# EAGLE design PolyMath (EAGLE 9.6.2)

## Sheet 1 of 7
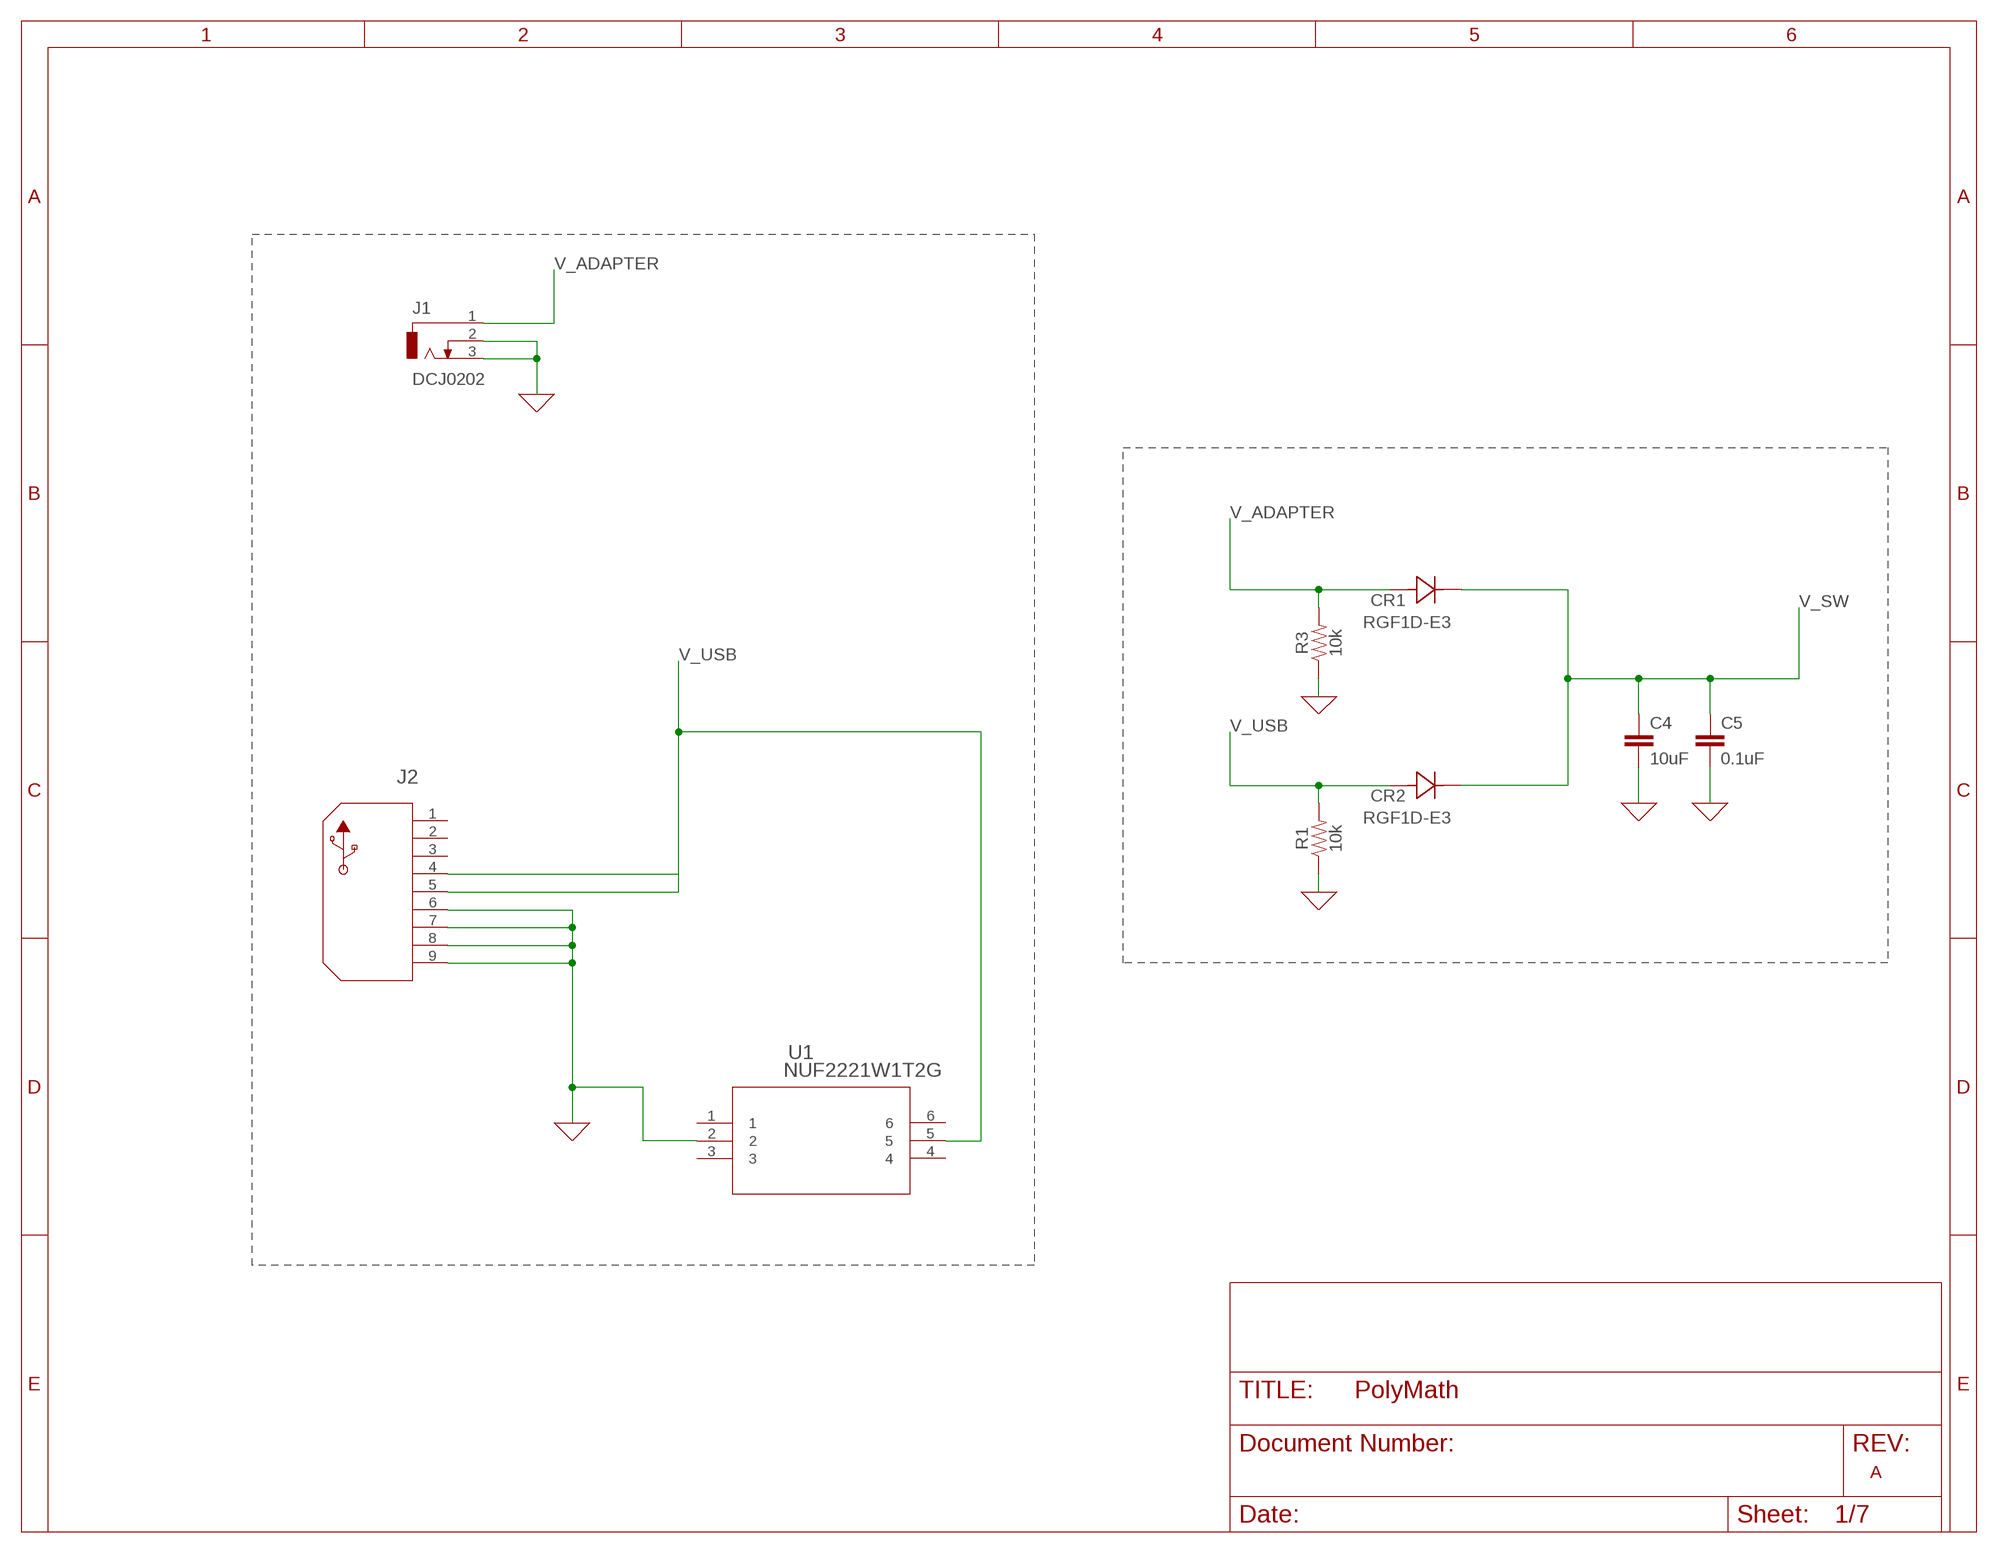
[diagram p0: schematic, sheet 1]

### Parts
C4  10uF  10UF-0603-6.3V-20%  [0603]
C5  0.1uF  0.1UF-0603-25V-(+80/-20%)  [0603]
CR1  RGF1D-E3  [DIODE_DO214BA]
CR2  RGF1D-E3  [DIODE_DO214BA]
J1  DCJ0202  [DCJ0202]
J2  1734035-4  [CONN5_USB1734035_TEC]
R1  10k  10KOHM-0603-1/10W-1%  [0603]
R3  10k  10KOHM-0603-1/10W-1%  [0603]
U1  NUF2221W1T2G  [SOIC6_SC70_1P35X2P2_ONS]

### Nets
0: C4.2 C5.2 J1.2 J1.3 J2.6 J2.7 J2.8 J2.9 R1.1 R3.1 U1.2 ; supply symbol labelled GND ; also sheet 2,3,4,5,6,7
V_ADAPTER: CR1.2 J1.1 R3.2
V_SW: C4.1 C5.1 CR1.1 CR2.1 ; also sheet 2
V_USB: CR2.2 J2.4 J2.5 R1.2 U1.5
Unconnected: J2.1 J2.2 J2.3 U1.1 U1.3 U1.4 U1.6

### Notes on the sheet
- A

## Sheet 2 of 7
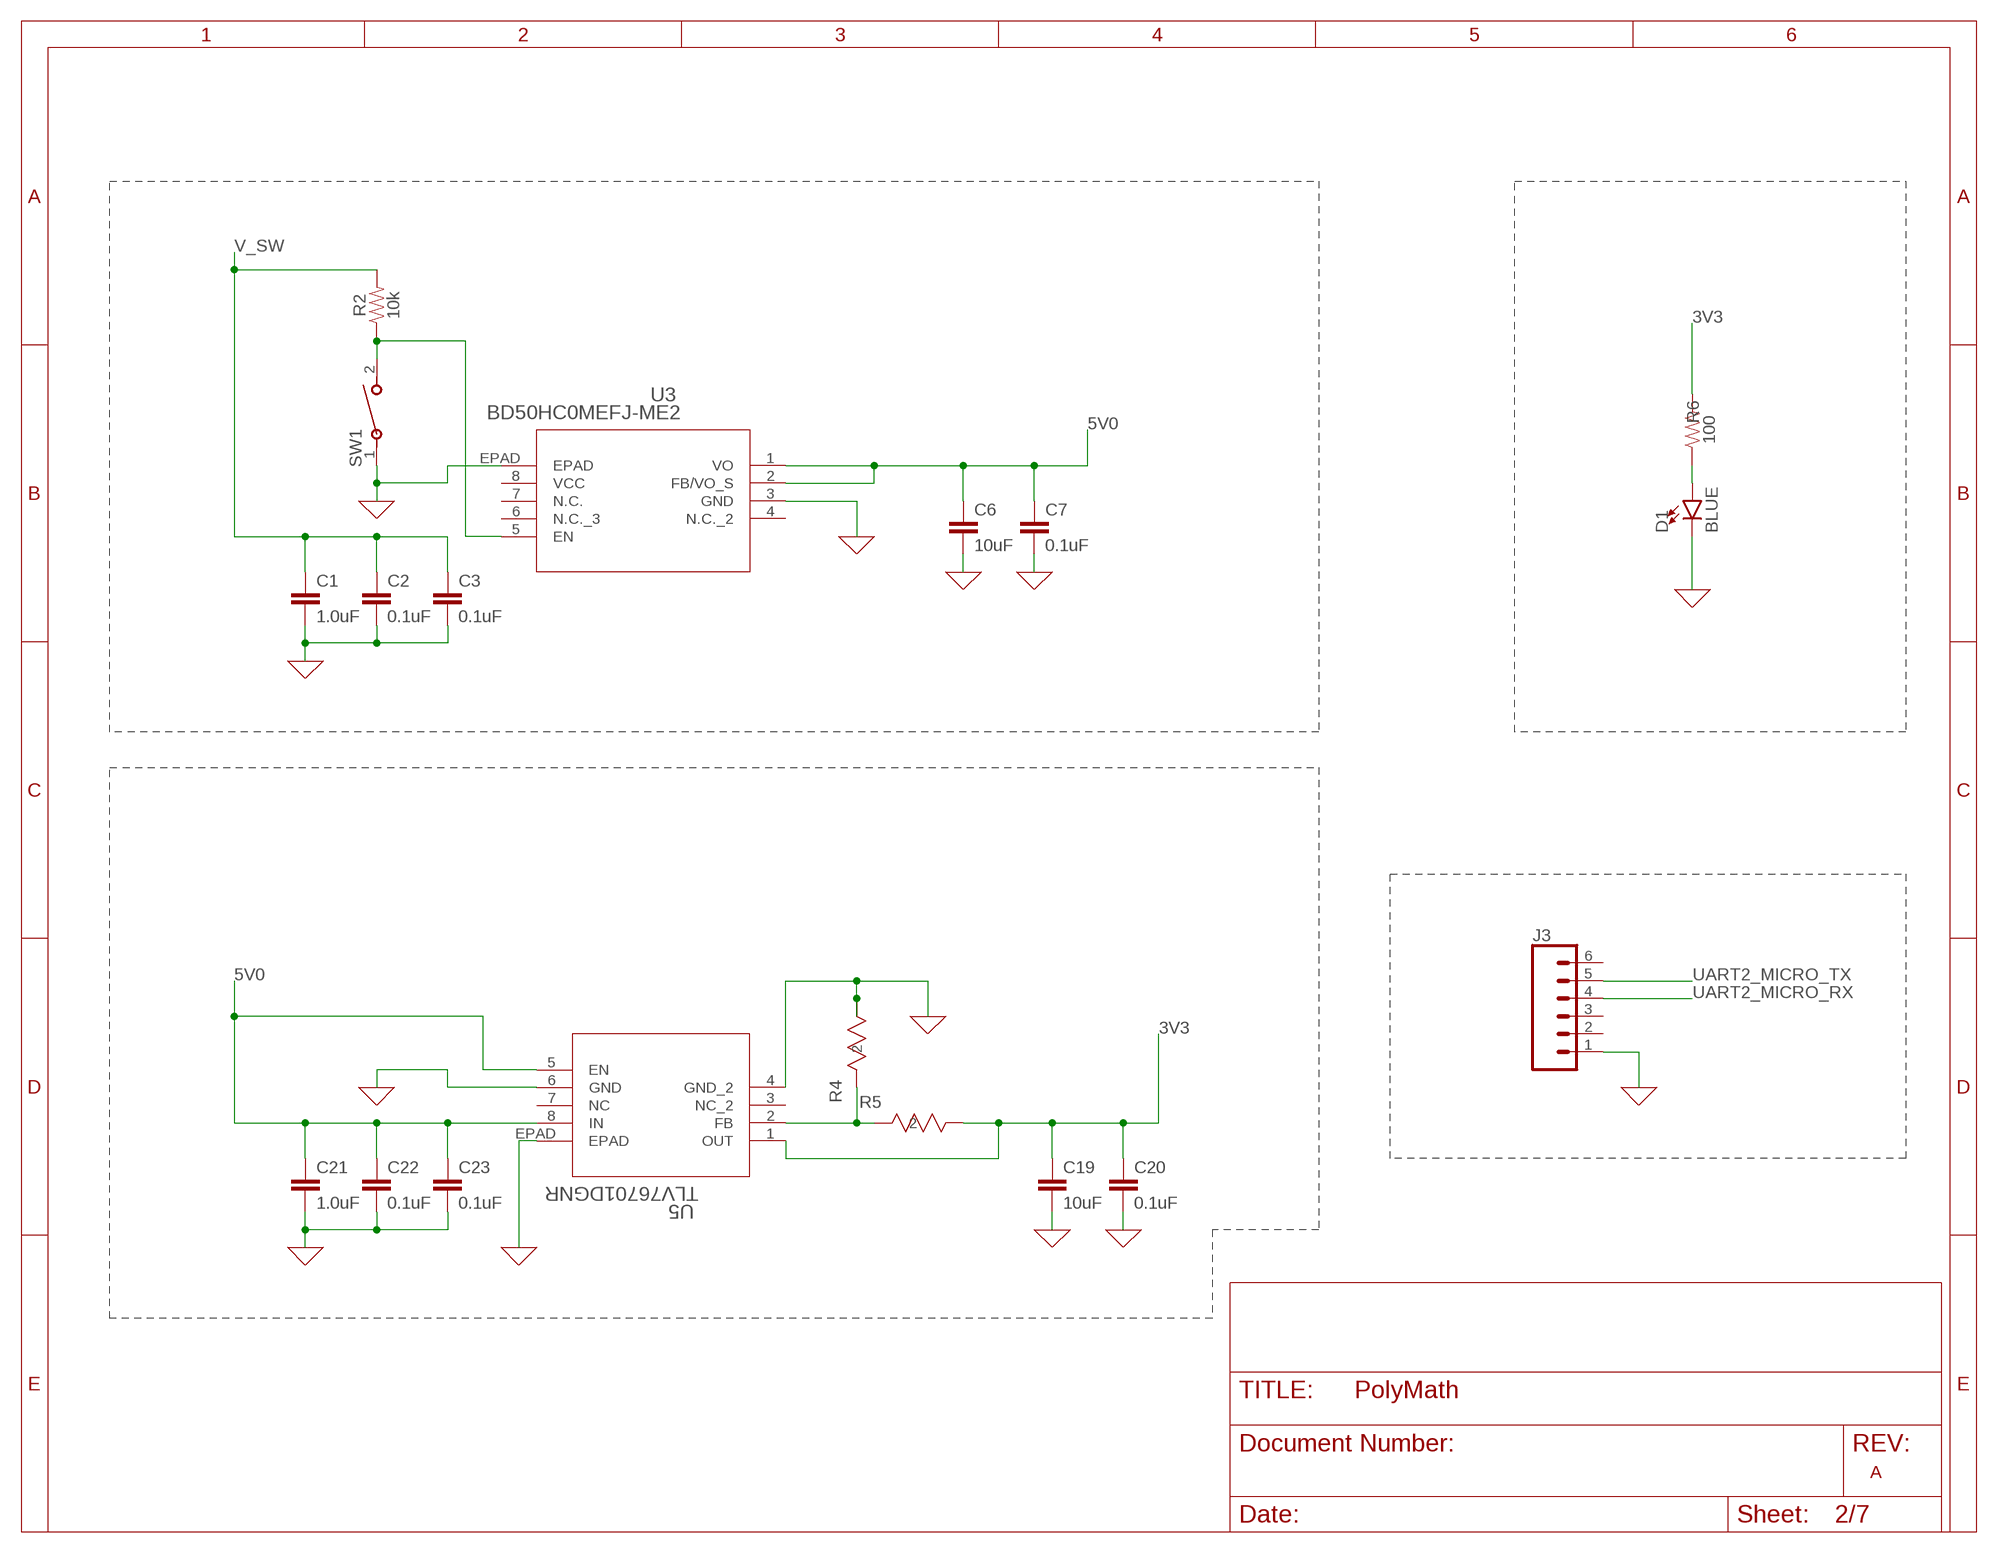
[diagram p1: schematic, sheet 2]

### Parts
C1  1.0uF  1.0UF-0603-16V-10%  [0603]
C2  0.1uF  0.1UF-0603-25V-5%  [0603]
C3  0.1uF  0.1UF-0603-25V-5%  [0603]
C6  10uF  10UF-0603-6.3V-20%  [0603]
C7  0.1uF  0.1UF-0603-25V-(+80/-20%)  [0603]
C19  10uF  10UF-0603-6.3V-20%  [0603]
C20  0.1uF  0.1UF-0603-25V-(+80/-20%)  [0603]
C21  1.0uF  1.0UF-0603-16V-10%  [0603]
C22  0.1uF  0.1UF-0603-25V-5%  [0603]
C23  0.1uF  0.1UF-0603-25V-5%  [0603]
D1  BLUE  LED-BLUE0603  [LED-0603]
J3  CONN_06NO_SILK_FEMALE_PTH  [1X06_NO_SILK]
R2  10k  10KOHM-0603-1/10W-1%  [0603]
R4  TNPW0603160KBEEA  [RC0603N_VIS]
R5  CRCW0603499KFKEA  [RES_CRCW_0603]
R6  100  100OHM-0603-1/4W-5%  [0603]
SW1  TL9320AF400QG  [SW_TL9320_EWI]
U3  BD50HC0MEFJ-ME2  [HTSOP-J8_ROM]
U5  TLV76701DGNR  [SOIC_01DGNR_TEX]

### Nets
0: C1.2 C2.2 C3.2 C6.2 C7.2 C19.2 C20.2 C21.2 C22.2 C23.2 D1.C J3.1 R4.1 SW1.1 U3.3(GND) U3.EPAD U5.4(GND_2) U5.6(GND) U5.EPAD ; supply symbol labelled GND ; also sheet 1,3,4,5,6,7
3V3: C19.1 C20.1 R5.1 R6.2 U5.1(OUT) ; also sheet 3,4,5,6,7
5V0: C6.1 C7.1 C21.1 C22.1 C23.1 U3.1(VO) U3.2(FB/VO_S) U5.5(EN) U5.8(IN) ; also sheet 4,5,6,7
N$1: R2.1 SW1.2 U3.5(EN)
N$4: D1.A R6.1
N$8: R4.2 R5.2 U5.2(FB)
UART2_MICRO_RX: J3.4 ; also sheet 4,7
UART2_MICRO_TX: J3.5 ; also sheet 4,7
V_SW: C1.1 C2.1 C3.1 R2.2 ; also sheet 1
Unconnected: J3.2 J3.3 J3.6 U3.4(N.C._2) U3.6(N.C._3) U3.7(N.C.) U5.3(NC_2) U5.7(NC)

### Notes on the sheet
- A

## Sheet 3 of 7
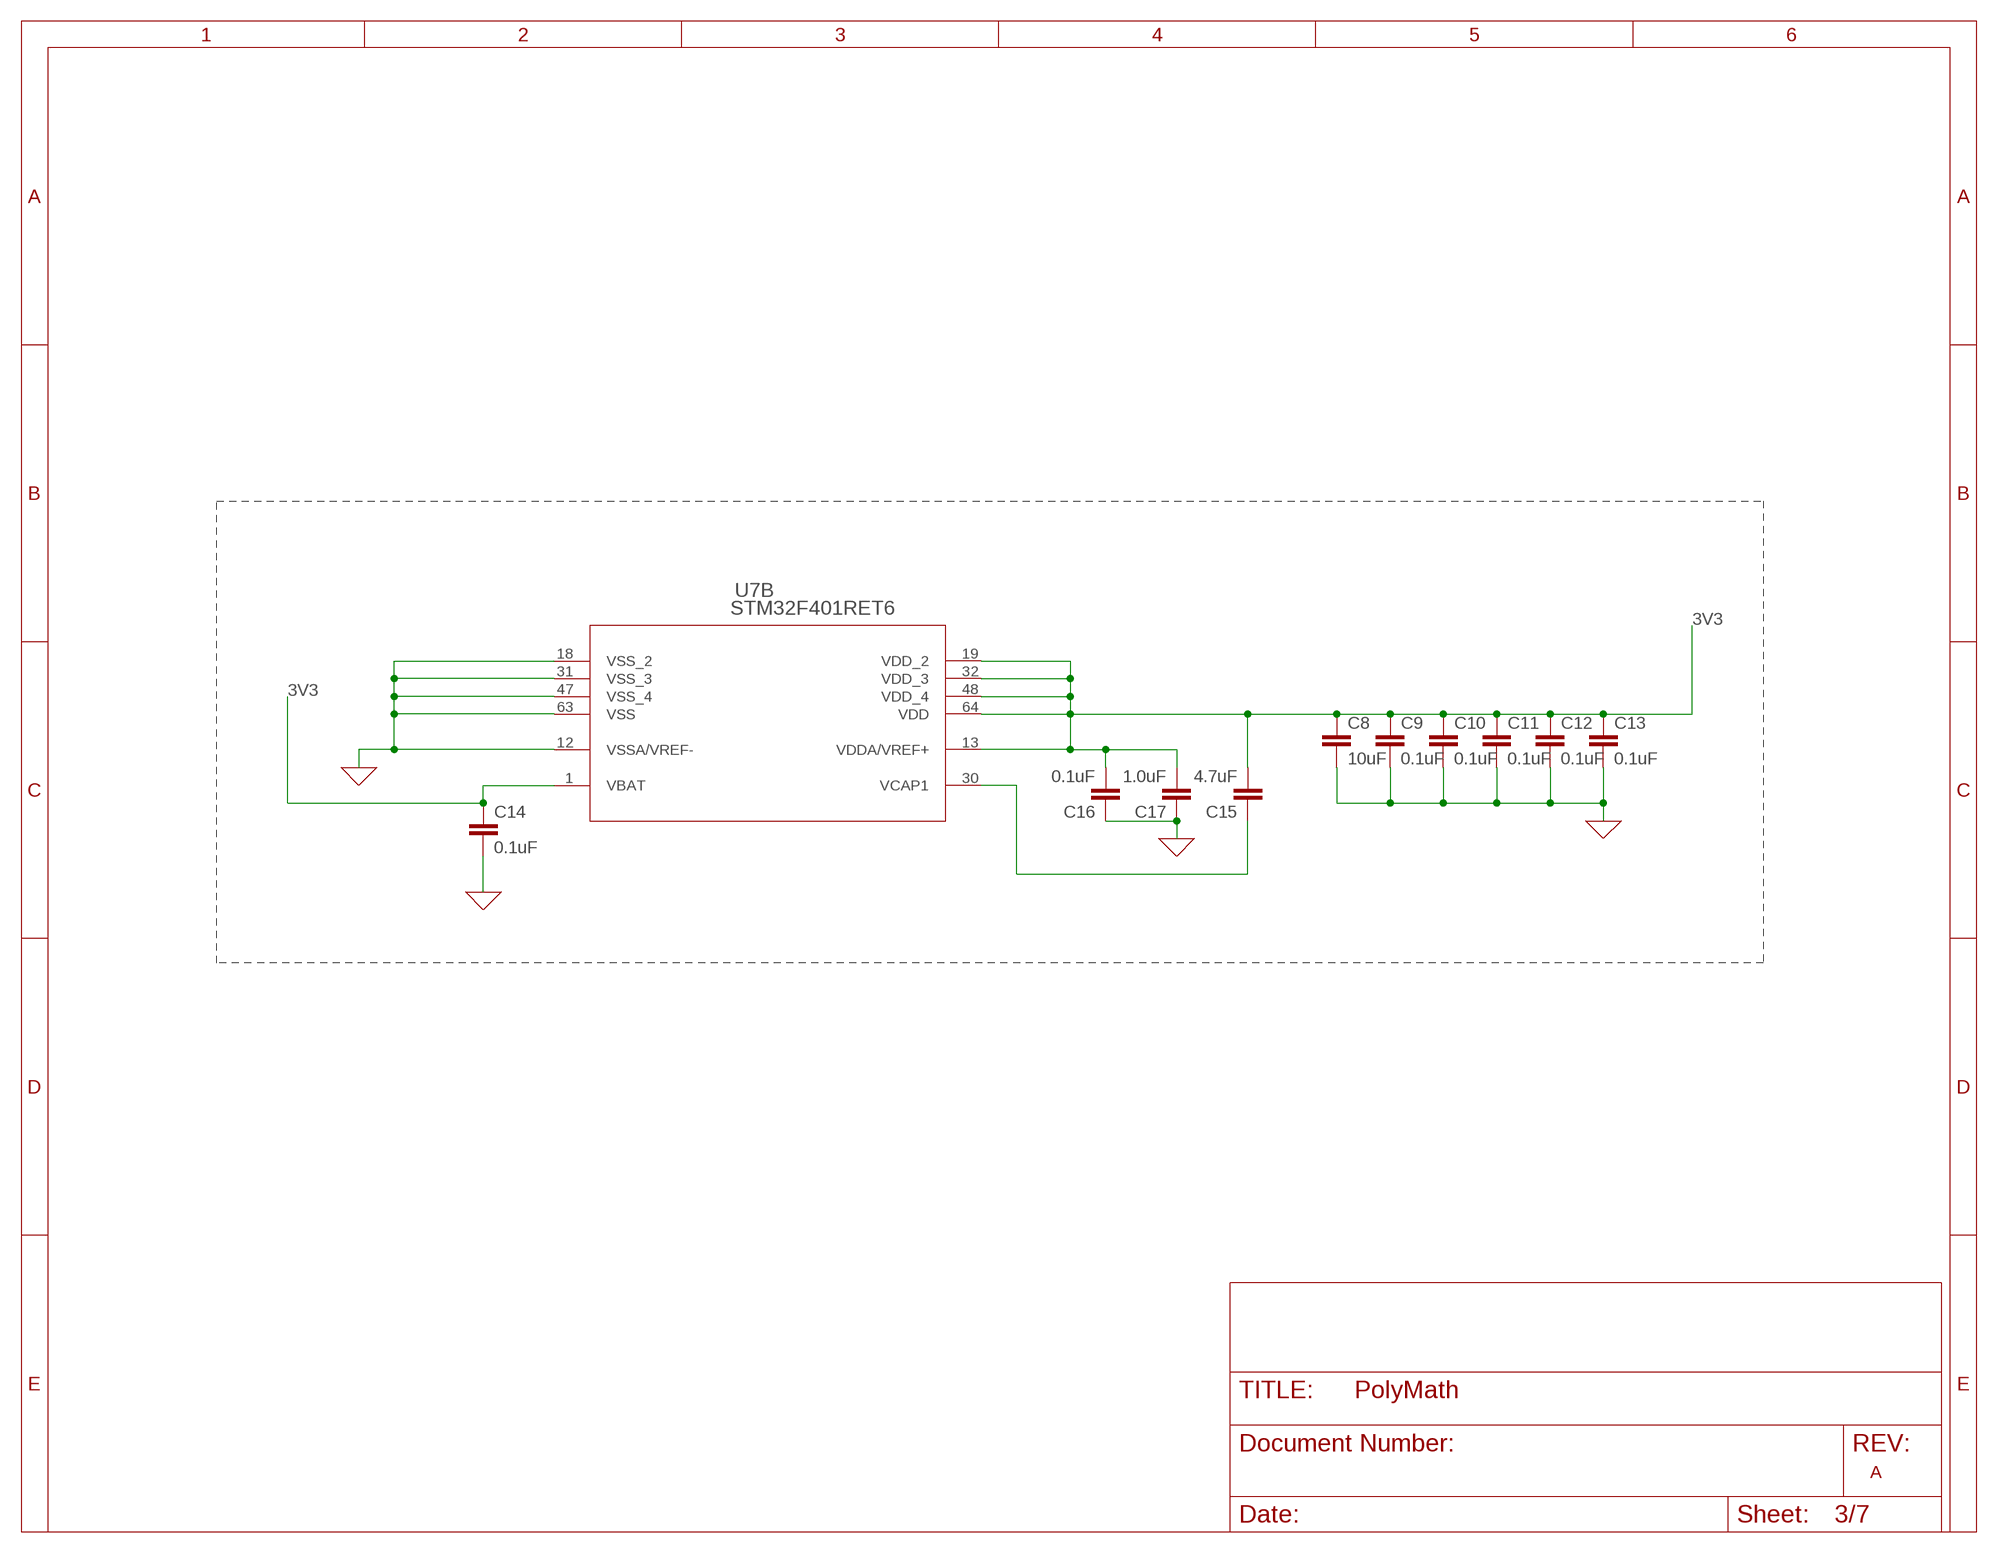
[diagram p2: schematic, sheet 3]

### Parts
C8  10uF  10UF-0805-10V-10%  [0805]
C9  0.1uF  0.1UF-0603-25V-5%  [0603]
C10  0.1uF  0.1UF-0603-25V-5%  [0603]
C11  0.1uF  0.1UF-0603-25V-5%  [0603]
C12  0.1uF  0.1UF-0603-25V-5%  [0603]
C13  0.1uF  0.1UF-0603-25V-5%  [0603]
C14  0.1uF  0.1UF-0603-25V-5%  [0603]
C15  4.7uF  4.7UF-0603-35V-(20%)  [0603]
C16  0.1uF  0.1UF-0603-25V-5%  [0603]
C17  1.0uF  1.0UF-0805-25V-(+80/-20%)  [0805]
U7  STM32F401RET6  [LQFP64-10X10MM]

### Nets
0: C8.2 C9.2 C10.2 C11.2 C12.2 C13.2 C14.2 C16.1 C17.1 U7.12(B:VSSA/VREF-) U7.18(B:VSS_2) U7.31(B:VSS_3) U7.47(B:VSS_4) U7.63(B:VSS) ; supply symbol labelled GND ; also sheet 1,2,4,5,6,7
3V3: C8.1 C9.1 C10.1 C11.1 C12.1 C13.1 C14.1 C15.2 C16.2 C17.2 U7.1(B:VBAT) U7.13(B:VDDA/VREF+) U7.19(B:VDD_2) U7.32(B:VDD_3) U7.48(B:VDD_4) U7.64(B:VDD) ; also sheet 2,4,5,6,7
N$7: C15.1 U7.30(B:VCAP1)

### Notes on the sheet
- A

## Sheet 4 of 7
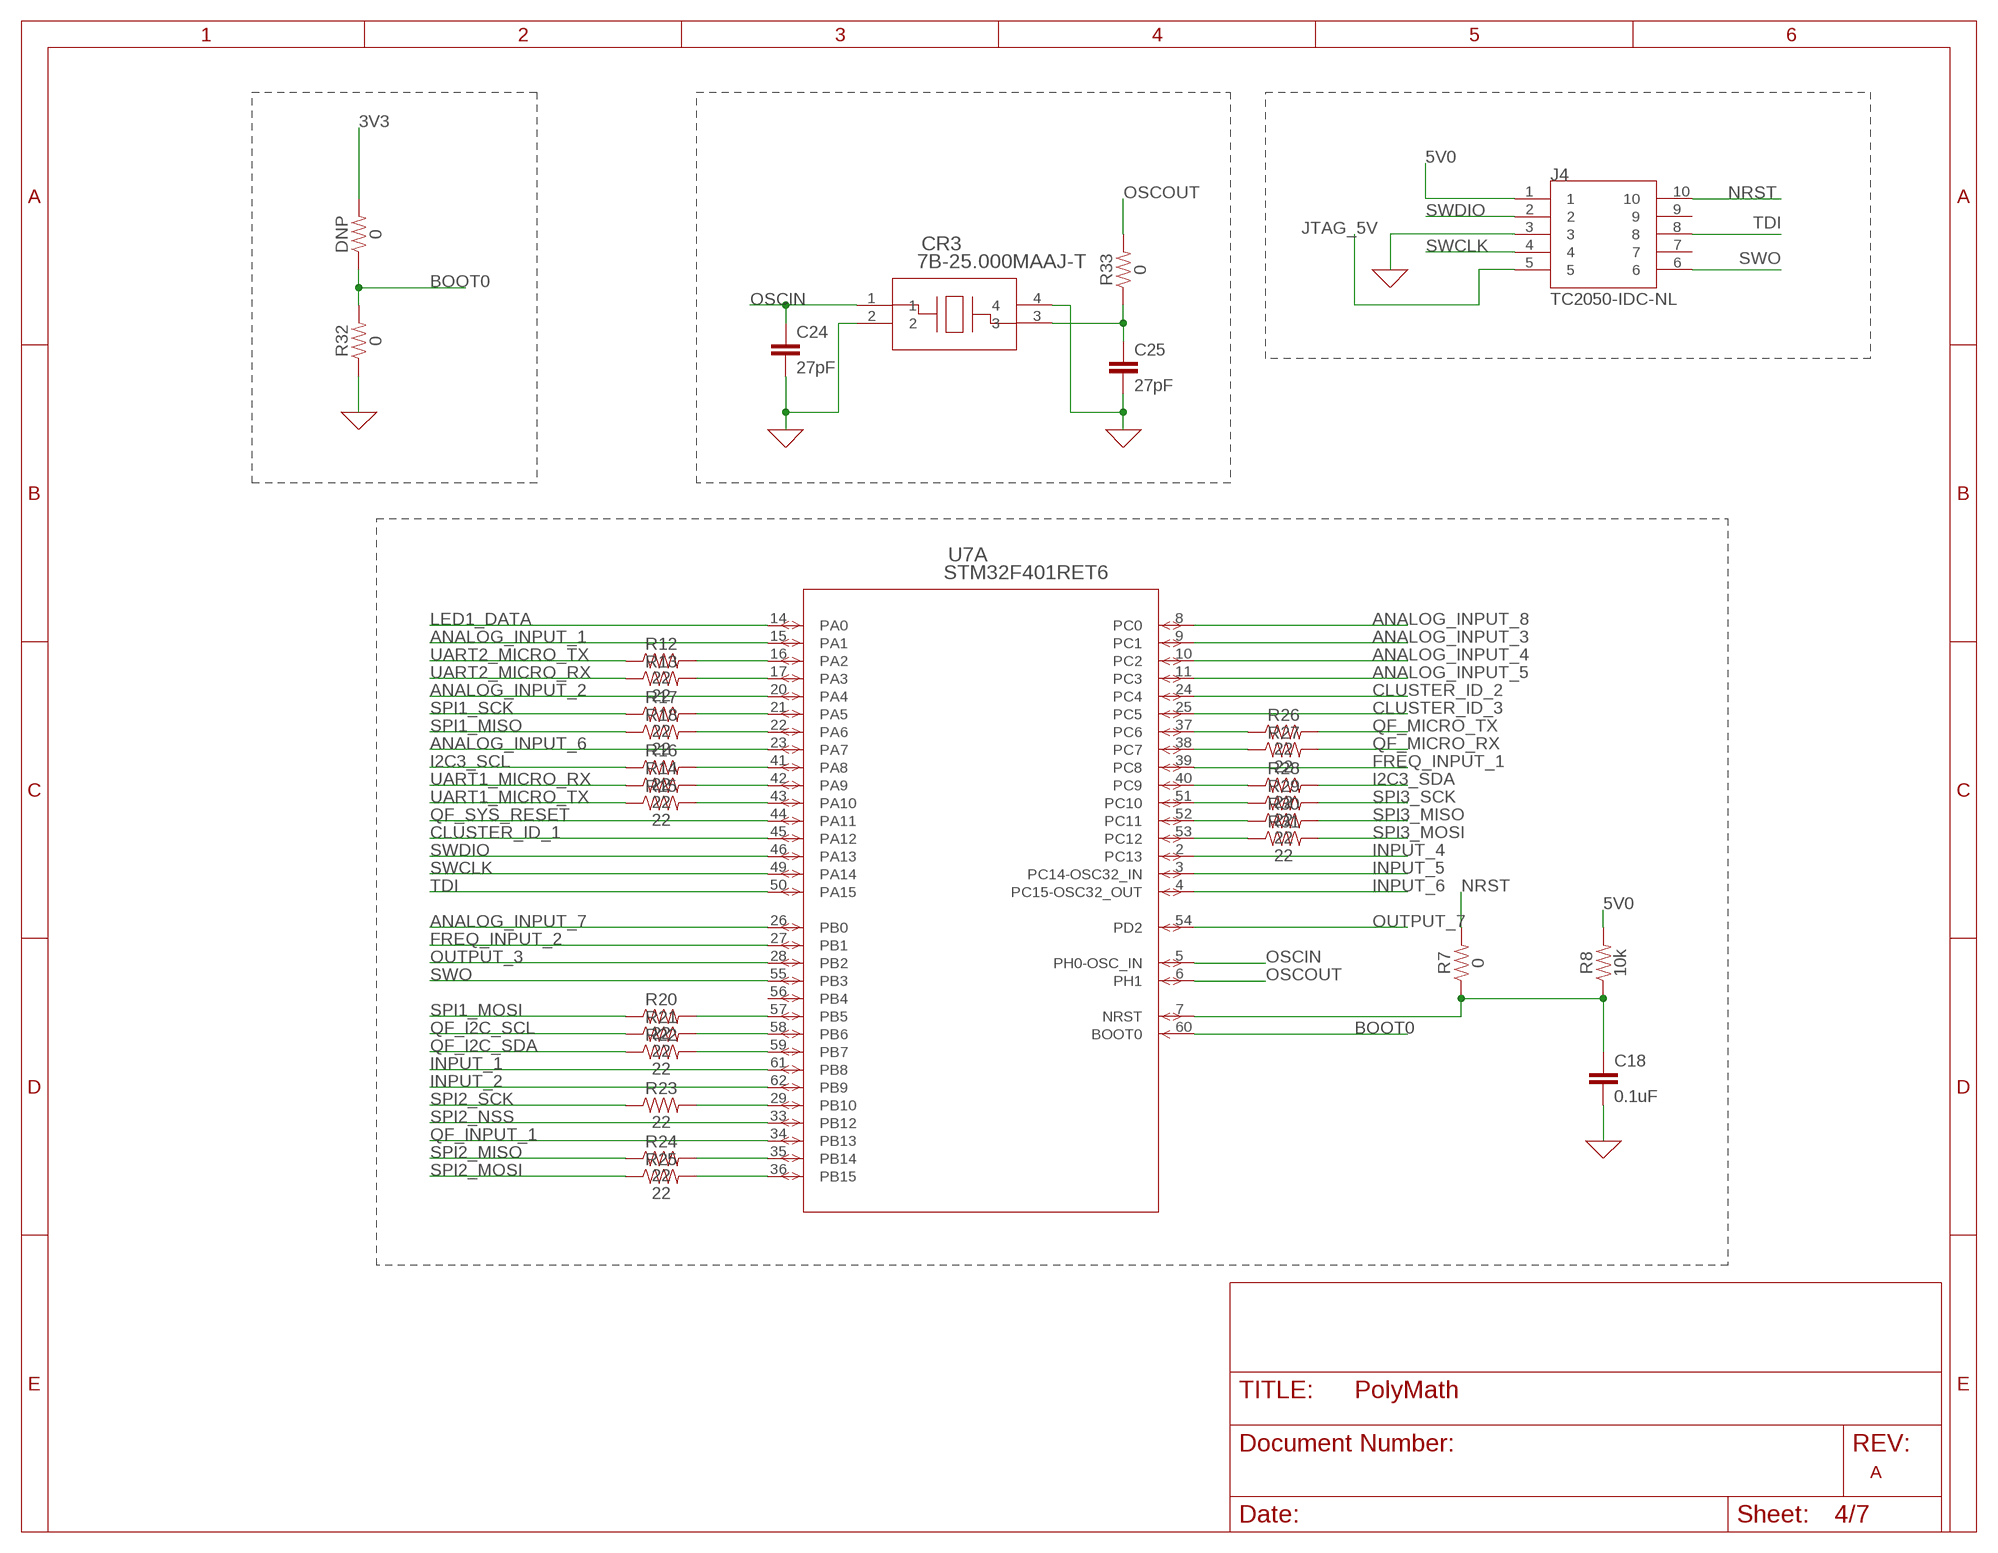
[diagram p3: schematic, sheet 4]

### Parts
C18  0.1uF  0.1UF-0603-25V-5%  [0603]
C24  27pF  27PF-0603-50V-5%  [0603]
C25  27pF  27PF-0603-50V-5%  [0603]
CR3  7B-25.000MAAJ-T  [CRYSTAL_TXC_7B]
DNP  0  0OHM-0603-1/10W  [0603]
J4  TC2050-IDC-NL  [TAG-CONNECT_TC2050-IDC-NL]
R7  0  0OHM-0603-1/10W  [0603]
R8  10k  10KOHM-0603-1/10W-1%  [0603]
R12  22  22OHM-0402-1/10W-1%  [0402]
R13  22  22OHM-0402-1/10W-1%  [0402]
R14  22  22OHM-0402-1/10W-1%  [0402]
R15  22  22OHM-0402-1/10W-1%  [0402]
R16  22  22OHM-0402-1/10W-1%  [0402]
R17  22  22OHM-0402-1/10W-1%  [0402]
R18  22  22OHM-0402-1/10W-1%  [0402]
R20  22  22OHM-0402-1/10W-1%  [0402]
R21  22  22OHM-0402-1/10W-1%  [0402]
R22  22  22OHM-0402-1/10W-1%  [0402]
R23  22  22OHM-0402-1/10W-1%  [0402]
R24  22  22OHM-0402-1/10W-1%  [0402]
R25  22  22OHM-0402-1/10W-1%  [0402]
R26  22  22OHM-0402-1/10W-1%  [0402]
R27  22  22OHM-0402-1/10W-1%  [0402]
R28  22  22OHM-0402-1/10W-1%  [0402]
R29  22  22OHM-0402-1/10W-1%  [0402]
R30  22  22OHM-0402-1/10W-1%  [0402]
R31  22  22OHM-0402-1/10W-1%  [0402]
R32  0  0OHM-0603-1/10W  [0603]
R33  0  0OHM-0603-1/10W  [0603]

### Nets
0: C18.2 C24.2 C25.2 CR3.2 CR3.4 J4.3 R32.1 ; supply symbol labelled GND ; also sheet 1,2,3,5,6,7
3V3: DNP.2 ; also sheet 2,3,5,6,7
5V0: J4.1 ; also sheet 2,5,6,7
ANALOG_INPUT_1: U7.15(A:PA1) ; also sheet 7
ANALOG_INPUT_2: U7.20(A:PA4) ; also sheet 7
ANALOG_INPUT_3: U7.9(A:PC1) ; also sheet 7
ANALOG_INPUT_4: U7.10(A:PC2) ; also sheet 7
ANALOG_INPUT_5: U7.11(A:PC3) ; also sheet 7
ANALOG_INPUT_6: U7.23(A:PA7) ; also sheet 7
ANALOG_INPUT_7: U7.26(A:PB0) ; also sheet 7
ANALOG_INPUT_8: U7.8(A:PC0) ; also sheet 7
BOOT0: DNP.1 R32.2 U7.60(A:BOOT0)
CLUSTER_ID_1: U7.45(A:PA12) ; also sheet 7
CLUSTER_ID_2: U7.24(A:PC4) ; also sheet 7
CLUSTER_ID_3: U7.25(A:PC5) ; also sheet 7
FREQ_INPUT_1: U7.39(A:PC8) ; also sheet 7
FREQ_INPUT_2: U7.27(A:PB1) ; also sheet 7
I2C3_SCL: R16.1 ; also sheet 7
I2C3_SDA: R28.2 ; also sheet 7
INPUT_1: U7.61(A:PB8) ; also sheet 7
INPUT_2: U7.62(A:PB9) ; also sheet 7
INPUT_4: U7.2(A:PC13) ; also sheet 7
INPUT_5: U7.3(A:PC14-OSC32_IN) ; also sheet 7
INPUT_6: U7.4(A:PC15-OSC32_OUT)
JTAG_5V: J4.5
LED1_DATA: U7.14(A:PA0) ; also sheet 7
N$5: C18.1 R7.1 R8.1 U7.7(A:NRST)
N$6: C25.1 CR3.3 R33.1
N$9: R12.2 U7.16(A:PA2)
N$11: R13.2 U7.17(A:PA3)
N$12: R8.2
N$13: R14.2 U7.42(A:PA9)
N$14: R15.2 U7.43(A:PA10)
N$15: R16.2 U7.41(A:PA8)
N$16: R17.2 U7.21(A:PA5)
N$17: R18.2 U7.22(A:PA6)
N$19: R20.2 U7.57(A:PB5)
N$20: R21.2 U7.58(A:PB6)
N$21: R22.2 U7.59(A:PB7)
N$22: R23.2 U7.29(A:PB10)
N$23: R24.2 U7.35(A:PB14)
N$24: R25.2 U7.36(A:PB15)
N$25: R26.1 U7.37(A:PC6)
N$26: R27.1 U7.38(A:PC7)
N$27: R28.1 U7.40(A:PC9)
N$28: R29.1 U7.51(A:PC10)
N$29: R30.1 U7.52(A:PC11)
N$30: R31.1 U7.53(A:PC12)
NRST: J4.10 R7.2
OSCIN: C24.1 CR3.1 U7.5(A:PH0-OSC_IN)
OSCOUT: R33.2 U7.6(A:PH1)
OUTPUT_3: U7.28(A:PB2) ; also sheet 7
OUTPUT_7: U7.54(A:PD2) ; also sheet 7
QF_I2C_SCL: R21.1 ; also sheet 5
QF_I2C_SDA: R22.1 ; also sheet 5
QF_INPUT_1: U7.34(A:PB13) ; also sheet 5
QF_MICRO_RX: R27.2 ; also sheet 5
QF_MICRO_TX: R26.2 ; also sheet 5
QF_SYS_RESET: U7.44(A:PA11) ; also sheet 5
SPI1_MISO: R18.1 ; also sheet 7
SPI1_MOSI: R20.1 ; also sheet 7
SPI1_SCK: R17.1 ; also sheet 7
SPI2_MISO: R24.1 ; also sheet 7
SPI2_MOSI: R25.1 ; also sheet 7
SPI2_NSS: U7.33(A:PB12) ; also sheet 7
SPI2_SCK: R23.1 ; also sheet 7
SPI3_MISO: R30.2 ; also sheet 7
SPI3_MOSI: R31.2 ; also sheet 7
SPI3_SCK: R29.2 ; also sheet 7
SWCLK: J4.4 U7.49(A:PA14)
SWDIO: J4.2 U7.46(A:PA13)
SWO: J4.6 U7.55(A:PB3)
TDI: J4.8 U7.50(A:PA15)
UART1_MICRO_RX: R14.1 ; also sheet 7
UART1_MICRO_TX: R15.1 ; also sheet 7
UART2_MICRO_RX: R13.1 ; also sheet 2,7
UART2_MICRO_TX: R12.1 ; also sheet 2,7
Unconnected: J4.7 J4.9 U7.56(A:PB4)

### Notes on the sheet
- A

## Sheet 5 of 7
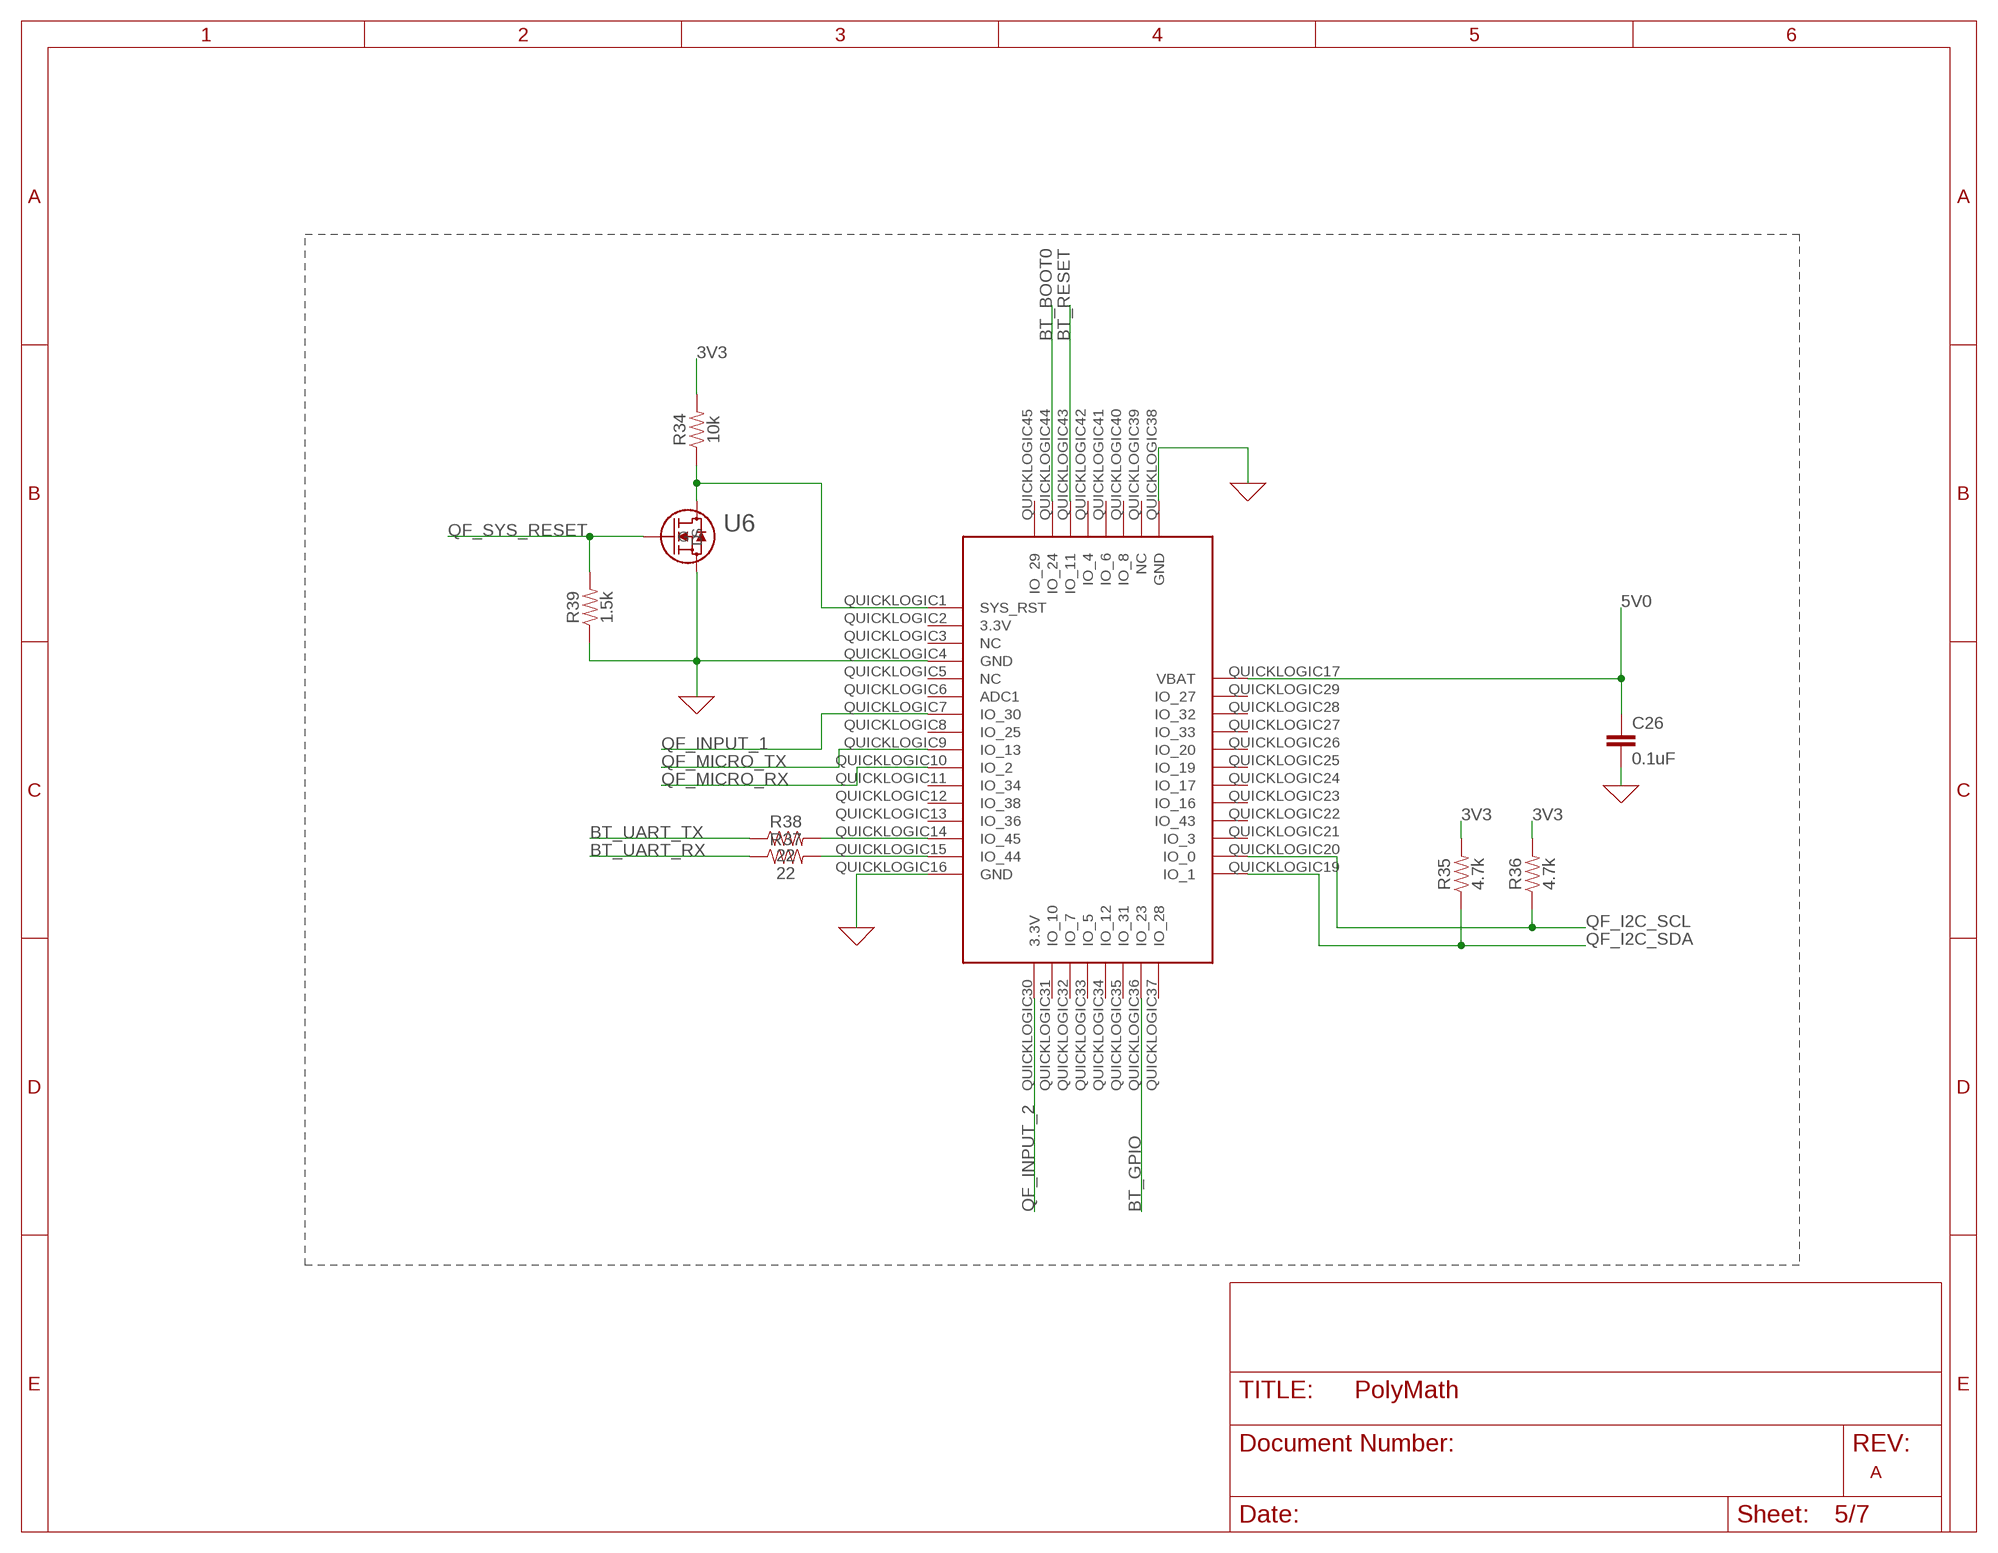
[diagram p4: schematic, sheet 5]

### Parts
C26  0.1uF  0.1UF-0603-25V-(+80/-20%)  [0603]
R34  10k  10KOHM-0603-1/10W-1%  [0603]
R35  4.7k  4.7KOHM-0603-1/10W-1%  [0603]
R36  4.7k  4.7KOHM-0603-1/10W-1%  [0603]
R37  22  22OHM-0402-1/10W-1%  [0402]
R38  22  22OHM-0402-1/10W-1%  [0402]
R39  1.5k  1.5KOHM-0603-1/10W-1%  [0603]
U6  DMN65D8L-7SOT-23_2P9X1P3_DIO-M  [SOT-23_2P9X1P3_DIO-M]
U$1  QUICKFEATHER  [QUICKLOGIC]

### Nets
0: C26.2 R39.1 U6.3(S) U$1.QUICKLOGIC4(GND) U$1.QUICKLOGIC16(GND) U$1.QUICKLOGIC38(GND) ; supply symbol labelled GND ; also sheet 1,2,3,4,6,7
3V3: R34.2 R35.2 R36.2 ; also sheet 2,3,4,6,7
5V0: C26.1 U$1.QUICKLOGIC17(VBAT) ; also sheet 2,4,6,7
BT_BOOT0: U$1.QUICKLOGIC44(IO_24) ; also sheet 6
BT_GPIO: U$1.QUICKLOGIC36(IO_23) ; also sheet 6
BT_RESET: U$1.QUICKLOGIC43(IO_11) ; also sheet 6
BT_UART_RX: R37.1 ; also sheet 6
BT_UART_TX: R38.1 ; also sheet 6
N$31: R34.1 U6.2(D) U$1.QUICKLOGIC1(SYS_RST)
N$34: R38.2 U$1.QUICKLOGIC14(IO_45)
N$35: R37.2 U$1.QUICKLOGIC15(IO_44)
QF_I2C_SCL: R36.1 U$1.QUICKLOGIC20(IO_0) ; also sheet 4
QF_I2C_SDA: R35.1 U$1.QUICKLOGIC19(IO_1) ; also sheet 4
QF_INPUT_1: U$1.QUICKLOGIC7(IO_30) ; also sheet 4
QF_INPUT_2: U$1.QUICKLOGIC30(3.3V)
QF_MICRO_RX: U$1.QUICKLOGIC10(IO_2) ; also sheet 4
QF_MICRO_TX: U$1.QUICKLOGIC9(IO_13) ; also sheet 4
QF_SYS_RESET: R39.2 U6.1(G) ; also sheet 4
Unconnected: U$1.QUICKLOGIC2(3.3V) U$1.QUICKLOGIC3(NC) U$1.QUICKLOGIC5(NC) U$1.QUICKLOGIC6(ADC1) U$1.QUICKLOGIC8(IO_25) U$1.QUICKLOGIC11(IO_34) U$1.QUICKLOGIC12(IO_38) U$1.QUICKLOGIC13(IO_36) U$1.QUICKLOGIC21(IO_3) U$1.QUICKLOGIC22(IO_43) U$1.QUICKLOGIC23(IO_16) U$1.QUICKLOGIC24(IO_17) U$1.QUICKLOGIC25(IO_19) U$1.QUICKLOGIC26(IO_20) U$1.QUICKLOGIC27(IO_33) U$1.QUICKLOGIC28(IO_32) U$1.QUICKLOGIC29(IO_27) U$1.QUICKLOGIC31(IO_10) U$1.QUICKLOGIC32(IO_7) U$1.QUICKLOGIC33(IO_5) U$1.QUICKLOGIC34(IO_12) U$1.QUICKLOGIC35(IO_31) U$1.QUICKLOGIC37(IO_28) U$1.QUICKLOGIC39(NC) U$1.QUICKLOGIC40(IO_8) U$1.QUICKLOGIC41(IO_6) U$1.QUICKLOGIC42(IO_4) U$1.QUICKLOGIC45(IO_29)

### Notes on the sheet
- A

## Sheet 6 of 7
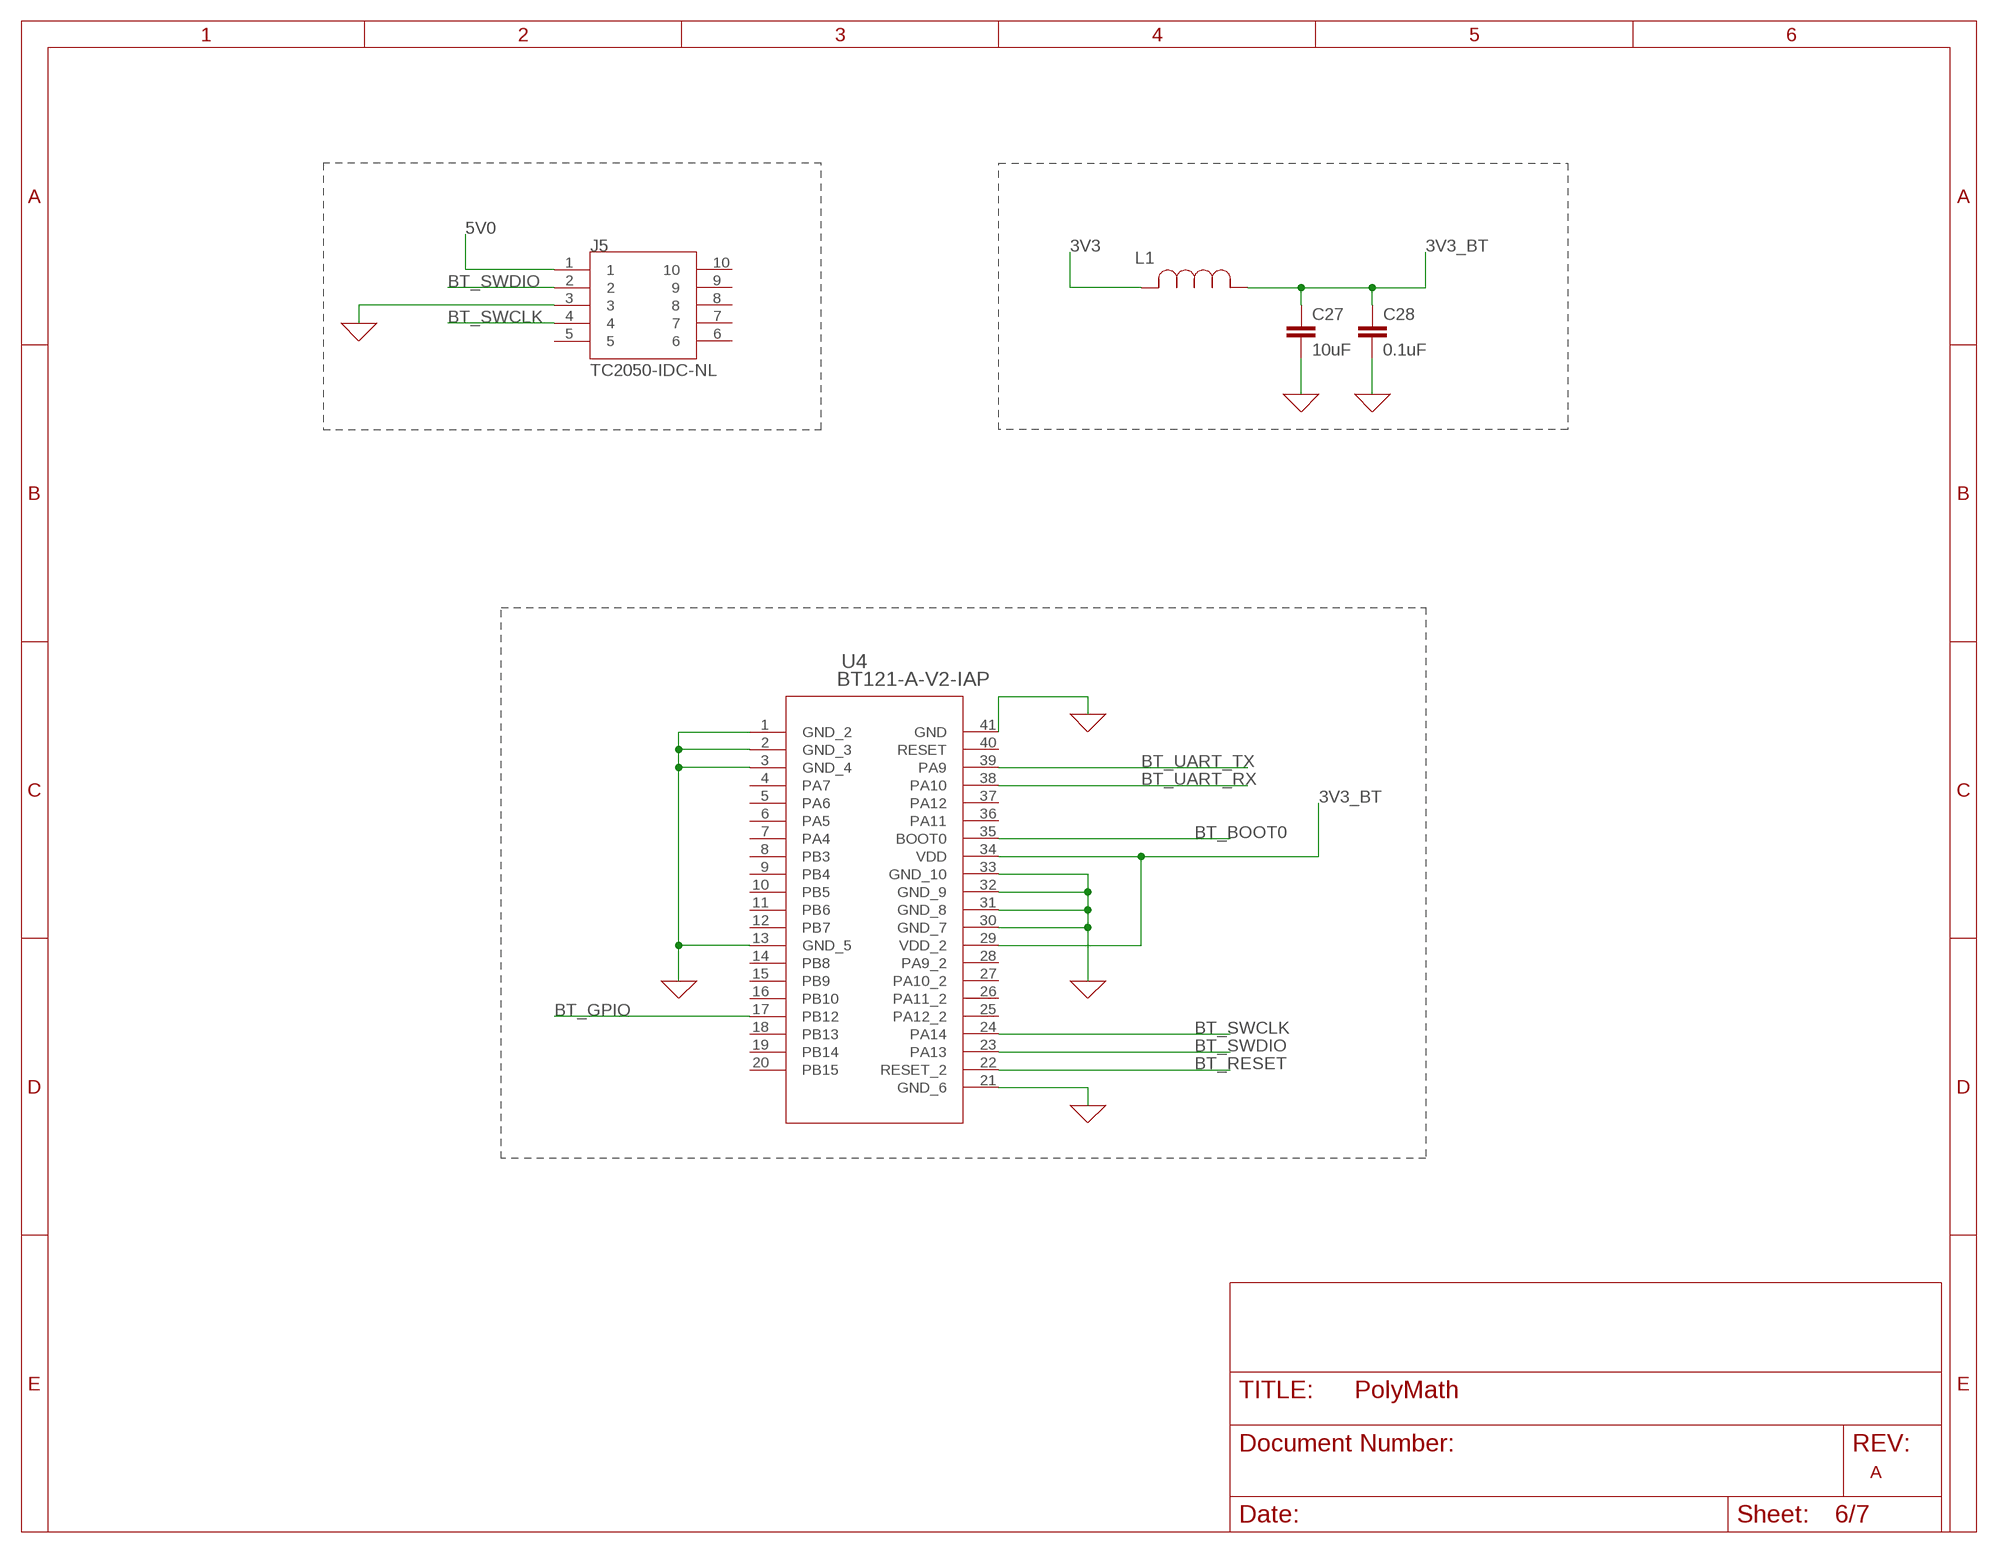
[diagram p5: schematic, sheet 6]

### Parts
C27  10uF  10UF-0603-6.3V-20%  [0603]
C28  0.1uF  0.1UF-0603-25V-(+80/-20%)  [0603]
J5  TC2050-IDC-NL  [TAG-CONNECT_TC2050-IDC-NL]
L1  MMZ1608Y121BTA00IND_1608_TDK-L  [IND_1608_TDK-L]
U4  BT121-A-V2-IAP  [SMD41_13P9X11_SIL]

### Nets
0: C27.2 C28.2 J5.3 U4.1(GND_2) U4.2(GND_3) U4.3(GND_4) U4.13(GND_5) U4.21(GND_6) U4.30(GND_7) U4.31(GND_8) U4.32(GND_9) U4.33(GND_10) U4.41(GND) ; supply symbol labelled GND ; also sheet 1,2,3,4,5,7
3V3: L1.2 ; also sheet 2,3,4,5,7
3V3_BT: C27.1 C28.1 L1.1 U4.29(VDD_2) U4.34(VDD)
5V0: J5.1 ; also sheet 2,4,5,7
BT_BOOT0: U4.35(BOOT0) ; also sheet 5
BT_GPIO: U4.17(PB12) ; also sheet 5
BT_RESET: U4.22(RESET_2) ; also sheet 5
BT_SWCLK: J5.4 U4.24(PA14)
BT_SWDIO: J5.2 U4.23(PA13)
BT_UART_RX: U4.38(PA10) ; also sheet 5
BT_UART_TX: U4.39(PA9) ; also sheet 5
Unconnected: J5.5 J5.6 J5.7 J5.8 J5.9 J5.10 U4.4(PA7) U4.5(PA6) U4.6(PA5) U4.7(PA4) U4.8(PB3) U4.9(PB4) U4.10(PB5) U4.11(PB6) U4.12(PB7) U4.14(PB8) U4.15(PB9) U4.16(PB10) U4.18(PB13) U4.19(PB14) U4.20(PB15) U4.25(PA12_2) U4.26(PA11_2) U4.27(PA10_2) U4.28(PA9_2) U4.36(PA11) U4.37(PA12) U4.40(RESET)

### Notes on the sheet
- A

## Sheet 7 of 7
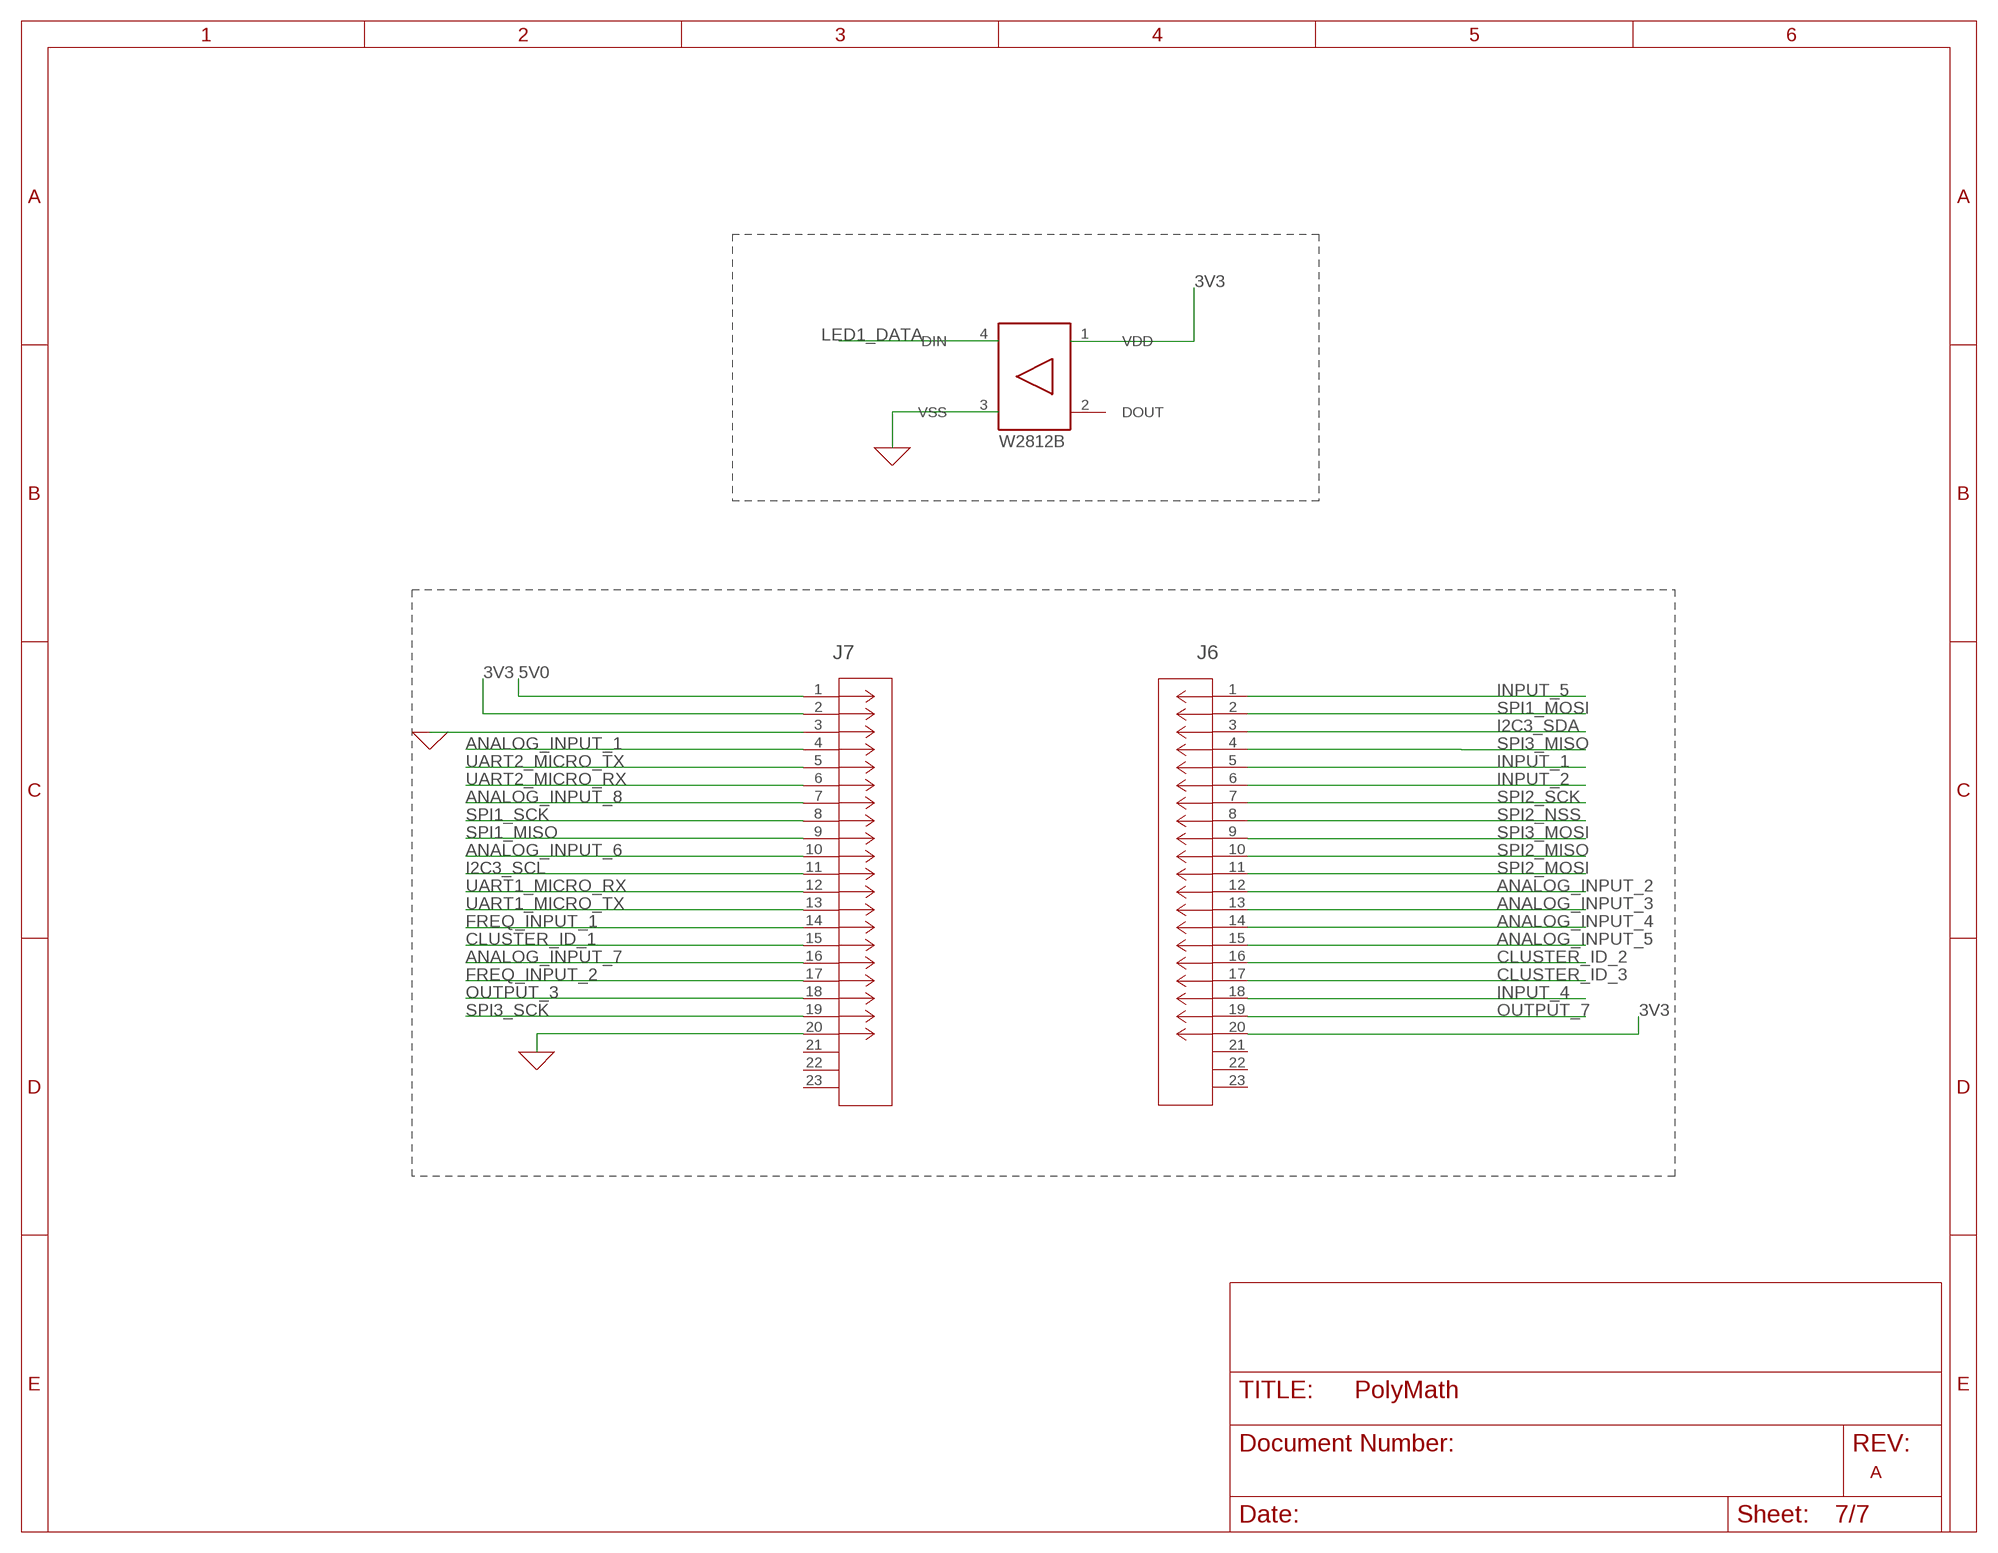
[diagram p6: schematic, sheet 7]

### Parts
J6  104074-4  [CONN20_104074_28P7X11P18_TEC]
J7  104074-4  [CONN20_104074_28P7X11P18_TEC]
U$2  WS2812B  [WS2812B]

### Nets
0: J7.3 J7.20 U$2.3(VSS) ; supply symbol labelled GND ; also sheet 1,2,3,4,5,6
3V3: J6.20 J7.2 U$2.1(VDD) ; also sheet 2,3,4,5,6
5V0: J7.1 ; also sheet 2,4,5,6
ANALOG_INPUT_1: J7.4 ; also sheet 4
ANALOG_INPUT_2: J6.12 ; also sheet 4
ANALOG_INPUT_3: J6.13 ; also sheet 4
ANALOG_INPUT_4: J6.14 ; also sheet 4
ANALOG_INPUT_5: J6.15 ; also sheet 4
ANALOG_INPUT_6: J7.10 ; also sheet 4
ANALOG_INPUT_7: J7.16 ; also sheet 4
ANALOG_INPUT_8: J7.7 ; also sheet 4
CLUSTER_ID_1: J7.15 ; also sheet 4
CLUSTER_ID_2: J6.16 ; also sheet 4
CLUSTER_ID_3: J6.17 ; also sheet 4
FREQ_INPUT_1: J7.14 ; also sheet 4
FREQ_INPUT_2: J7.17 ; also sheet 4
I2C3_SCL: J7.11 ; also sheet 4
I2C3_SDA: J6.3 ; also sheet 4
INPUT_1: J6.5 ; also sheet 4
INPUT_2: J6.6 ; also sheet 4
INPUT_4: J6.18 ; also sheet 4
INPUT_5: J6.1 ; also sheet 4
LED1_DATA: U$2.4(DIN) ; also sheet 4
OUTPUT_3: J7.18 ; also sheet 4
OUTPUT_7: J6.19 ; also sheet 4
SPI1_MISO: J7.9 ; also sheet 4
SPI1_MOSI: J6.2 ; also sheet 4
SPI1_SCK: J7.8 ; also sheet 4
SPI2_MISO: J6.10 ; also sheet 4
SPI2_MOSI: J6.11 ; also sheet 4
SPI2_NSS: J6.8 ; also sheet 4
SPI2_SCK: J6.7 ; also sheet 4
SPI3_MISO: J6.4 ; also sheet 4
SPI3_MOSI: J6.9 ; also sheet 4
SPI3_SCK: J7.19 ; also sheet 4
UART1_MICRO_RX: J7.12 ; also sheet 4
UART1_MICRO_TX: J7.13 ; also sheet 4
UART2_MICRO_RX: J7.6 ; also sheet 2,4
UART2_MICRO_TX: J7.5 ; also sheet 2,4
Unconnected: J6.21 J6.22 J6.23 J7.21 J7.22 J7.23 U$2.2(DOUT)

### Notes on the sheet
- A

## Power pins joined to a net without a drawn wire
VCC: U3.8(VCC)

## Library data of the parts
C1 C21 = SparkFun-Capacitors:1.0UF: 1µF ceramic capacitors A capacitor is a passive two-terminal electrical component used to store electrical energy temporarily in an electric field.; PROD_ID: CAP-00868
C2 C3 C9-C14 C16 C18 C22 C23 = SparkFun-Capacitors:0.1UF: 0.1µF ceramic capacitors A capacitor is a passive two-terminal electrical component used to store electrical energy temporarily in an electric field.; PROD_ID: CAP-08604
C4 C6 C19 C27 = SparkFun-Capacitors:10UF: 10.0µF ceramic capacitors A capacitor is a passive two-terminal electrical component used to store electrical energy temporarily in an electric field.; PROD_ID: CAP-11015
C5 C7 C20 C26 C28 = SparkFun-Capacitors:0.1UF: 0.1µF ceramic capacitors A capacitor is a passive two-terminal electrical component used to store electrical energy temporarily in an electric field.; PROD_ID: CAP-00810
C8 = SparkFun-Capacitors:10UF: 10.0µF ceramic capacitors A capacitor is a passive two-terminal electrical component used to store electrical energy temporarily in an electric field.; PROD_ID: CAP-11330
C15 = SparkFun-Capacitors:4.7UF: 4.7µF ceramic capacitors A capacitor is a passive two-terminal electrical component used to store electrical energy temporarily in an electric field.; PROD_ID: CAP-14106
C17 = SparkFun-Capacitors:1.0UF: 1µF ceramic capacitors A capacitor is a passive two-terminal electrical component used to store electrical energy temporarily in an electric field.; PROD_ID: CAP-11625
C24 C25 = SparkFun-Capacitors:27PF: 27pF ceramic capacitors A capacitor is a passive two-terminal electrical component used to store electrical energy temporarily in an electric field.; PROD_ID: CAP-09989
CR1 CR2 = D0214BA:RGF1D-E3; BUILT_BY: EMA_UL_Team; MANUFACTURER_PART_NUMBER: RGF1D-E3; VENDOR: Vishay
CR3 = 7B-25.000MAAJ-T:7B-25.000MAAJ-T; BUILT_BY: EMA_UL_Team; MANUFACTURER_PART_NUMBER: 7B-25.000MAAJ-T; VENDOR: TXC
D1 = SparkFun-LED:LED-BLUE: Blue SMD LED Used in manufacturing of various products at SparkFun Packages: 0603 - SMD 0603 package [Product Link] <http://www.digikey.com/product-detail/en/SMLE12BC7TT86/511-1589-2-ND/1641808> 1206 - SMD1206 package [Product Link] <http://www.digikey.com/product-detail/en/lite-on-inc/LTST-C150TBKT/160-1643-1-ND/573584> SparkFun Products: ESP8266 Thing-Dev Board <https://www.sparkfun.com/products/13711> RedBoard <https://www.sparkfun.com/products/12757>; PROD_ID: DIO-08575
DNP R7 R32 R33 = SparkFun-Resistors:0OHM: 0Ω resistor A resistor is a passive two-terminal electrical component that implements electrical resistance as a circuit element. Resistors act to reduce current flow, and, at the same time, act to lower voltage levels within circuits. - Wikipedia; PROD_ID: RES-08609
J1 = con-jack:DCJ0202: DC POWER JACK Source: DCJ0202.pdf; OC_FARNELL: unknown; OC_NEWARK: unknown
J2 = 1734035-4:1734035-4; BUILT_BY: EMA_UL_Team; COPYRIGHT: Copyright (C) 2016 Accelerated Designs. All rights reserved; DESCRIPTION: Mini USB,R/A,SMT,B Type,pbFree; MANUFACTURER_PART_NUMBER: 1734035-4; PITCH_MM_: 0.8; POSITIONS: 5; PRODUCT: Connector; ROWS-CONFIG: 1; SOURCELIBRARY: TE_Connectivity-2018-03-16; TE_PART_NUMBER: 1734035-4; TYPE: USB 2.0; VENDOR: TE Connectivity
J3 = SparkFun-Connectors:CONN_06: Multi connection point. Often used as Generic Header-pin footprint for 0.1 inch spaced/style header connections On any of the 0.1 inch spaced packages, you can populate with these: Break Away Headers - Straight <https://www.sparkfun.com/products/116> (PRT-00116) Break Away Male Headers - Right Angle <https://www.sparkfun.com/products/553> (PRT-00553) Female Headers <https://www.sparkfun.com/products/115> (PRT-00115) Break Away Headers - Machine Pin <https://www.sparkfun.com/products/117> (PRT-00117) Break Away Female Headers - Swiss Machine Pin <https://www.sparkfun.com/products/743> (PRT-00743) Arduino Stackable Header - 6 Pin <https://www.sparkfun.com/products/9280> (PRT-09280) For SCREWTERMINALS and SPRING TERMINALS visit here: Screw Terimnals on SparkFun.com <https://www.sparkfun.com/search/results?term=Screw+Terminals> (5mm/3.5mm/2.54mm spacing) This device is also useful as a general connection point to wire up your design to another part of your project. Our various solder wires solder well into these plated through hole pads. Hook-Up Wire - Assortment (Stranded, 22 AWG) <https://www.sparkfun.com/products/11375> (PRT-11375) Hook-Up Wire - Assortment (Solid Core, 22 AWG) <https://www.sparkfun.com/products/11367> (PRT-11367) View the entire wire category on our website here <https://www.sparkfun.com/categories/141>; PROD_ID: CONN-08437
J4 J5 = TC2050-IDC-NL:TC2050-IDC-NL: Cbl Plug-Of-Nails 10-Pin Check prices <https://pricing.snapeda.com/parts/TC2050-IDC-NL/Tag-Connect%20LLC/view-part?ref=eda>; AVAILABILITY: Warning; DESCRIPTION: MSP-FET430 Flash Emulation Tool Plug-Of-Nails™ Adapter Cable; MF: Tag-Connect LLC; MP: TC2050-IDC-NL; PACKAGE: None; PRICE: None; PURCHASE-URL: https://pricing.snapeda.com/search/part/TC2050-IDC-NL/?ref=eda
J6 J7 = 104074-4:104074-4; BUILT_BY: EMA_Anthony; COPYRIGHT: Copyright (C) 2016 Accelerated Designs. All rights reserved; MANUFACTURER_PART_NUMBER: 104074-4; PITCH_MM_: 0.05; POSITIONS: 20; PRODUCT: Connector; ROWS-CONFIG: 1; SOURCELIBRARY: TE_Connectivity_250_Part_Delivery_1_2018-08-13; TE_PART_NUMBER: 104074-4; TYPE: Header; VENDOR: TE Connectivity
L1 = MMZ1608Y121BTA00:MMZ1608Y121BTA00; BUILT_BY: EMA_UL_Team; MANUFACTURER_PART_NUMBER: MMZ1608Y121BTA00; SOURCELIBRARY: TDK_2015_05_22; VENDOR: TDK
R1-R3 R8 R34 = SparkFun-Resistors:10KOHM: 10kΩ resistor A resistor is a passive two-terminal electrical component that implements electrical resistance as a circuit element. Resistors act to reduce current flow, and, at the same time, act to lower voltage levels within circuits. - Wikipedia; PROD_ID: RES-00824
R4 = TNPW0603160KBEEA:TNPW0603160KBEEA; BUILT_BY: EMA_UL_Team; MANUFACTURER_PART_NUMBER: TNPW0603160KBEEA; SOURCELIBRARY: Vishay_2010-01-01_Res6; VENDOR: Vishay
R5 = CRCW0603499KFKEA:CRCW0603499KFKEA; BUILT_BY: EMA_UL_Team; MANUFACTURER_PART_NUMBER: CRCW0603499KFKEA; VENDOR: Vishay
R6 = SparkFun-Resistors:100OHM: 100Ω resistor A resistor is a passive two-terminal electrical component that implements electrical resistance as a circuit element. Resistors act to reduce current flow, and, at the same time, act to lower voltage levels within circuits. - Wikipedia; PROD_ID: RES-12438
R12-R18 R20-R31 R37 R38 = SparkFun-Resistors:22OHM: 22Ω resistor A resistor is a passive two-terminal electrical component that implements electrical resistance as a circuit element. Resistors act to reduce current flow, and, at the same time, act to lower voltage levels within circuits. - Wikipedia; PROD_ID: RES-12427
R35 R36 = SparkFun-Resistors:4.7KOHM: 4.7kΩ resistor A resistor is a passive two-terminal electrical component that implements electrical resistance as a circuit element. Resistors act to reduce current flow, and, at the same time, act to lower voltage levels within circuits. - Wikipedia; PROD_ID: RES-07857
R39 = SparkFun-Resistors:1.5KOHM: 1.5kΩ resistor A resistor is a passive two-terminal electrical component that implements electrical resistance as a circuit element. Resistors act to reduce current flow, and, at the same time, act to lower voltage levels within circuits. - Wikipedia; PROD_ID: RES-08306
SW1 = TL9320AF400QG:TL9320AF400QG; BUILT_BY: EMA_Cory; COPYRIGHT: Copyright (C) 2018 Accelerated Designs. All rights reserved; DATASHEET: https://sten-eswitch-13110800-production.s3.amazonaws.com/system/asset/product_line/data_sheet/249/TL9320.pdf; MANUFACTURER_PART_NUMBER: TL9320AF400QG; SOURCELIBRARY: Add_to_database_2020-11-10; VENDOR: E-Switch
U1 = NUF2221W1T2GSOIC6:NUF2221W1T2G; BUILT_BY: EMA_Anthony; COPYRIGHT: Copyright (C) 2016 Accelerated Designs. All rights reserved; MANUFACTURER_PART_NUMBER: NUF2221W1T2G; SOURCELIBRARY: ON_Semiconductor_2018-12-15; VENDOR: ON Semiconductor
U3 = BD50HC0MEFJ-ME2:BD50HC0MEFJ-ME2; BUILT_BY: EMA_Molly; COPYRIGHT: Copyright (C) 2018 Accelerated Designs. All rights reserved; MANUFACTURER_PART_NUMBER: BD50HC0MEFJ-ME2; SOURCELIBRARY: ROHM_2019-10-21; VENDOR: ROHM Semiconductor
U4 = BT121:BT121-A-V2-IAP; BUILT_BY: EMA_Jessica; COPYRIGHT: Copyright (C) 2018 Accelerated Designs. All rights reserved; MANUFACTURER_PART_NUMBER: BT121-A-V2-IAP; SOURCELIBRARY: Silicon_Labs_2020-01-01; VENDOR: Silicon Labs
U5 = TLV76733DGNR:TLV76701DGNR; BUILT_BY: EMA_Matt; COPYRIGHT: Copyright (C) 2018 Accelerated Designs. All rights reserved; DATASHEET: https://www.ti.com/lit/ds/symlink/tlv767.pdf?ts=1594658665902&ref_url=https%253A%252F%252Fwww.google.com%252F; MANUFACTURER_PART_NUMBER: TLV76701DGNR; SOURCELIBRARY: TI_2020-07-16; VENDOR: Texas Instruments
U6 = DMN65D8L:DMN65D8L-7; BUILT_BY: EMA_Anthony; COPYRIGHT: Copyright (C) 2018 Accelerated Designs. All rights reserved; DATASHEET: https://www.diodes.com/assets/Datasheets/DMN3023L.pdf; MANUFACTURER_PART_NUMBER: DMN65D8L-7; SOURCELIBRARY: Update_to_database_2020-12-03; VENDOR: Diodes Inc
U7 = stm32F401re:STM32F401RET6; BUILT_BY: EMA_UL_Team; COPYRIGHT: Copyright (C) 2018 Accelerated Designs. All rights reserved; MANUFACTURER_PART_NUMBER: STM32F401RET6; SOURCELIBRARY: Updates_to_database_2020-10-19; VENDOR: STMicroelectronics
U$1 = QuickFeather:QUICKFEATHER
U$2 = WS2812b:WS2812B

## Board
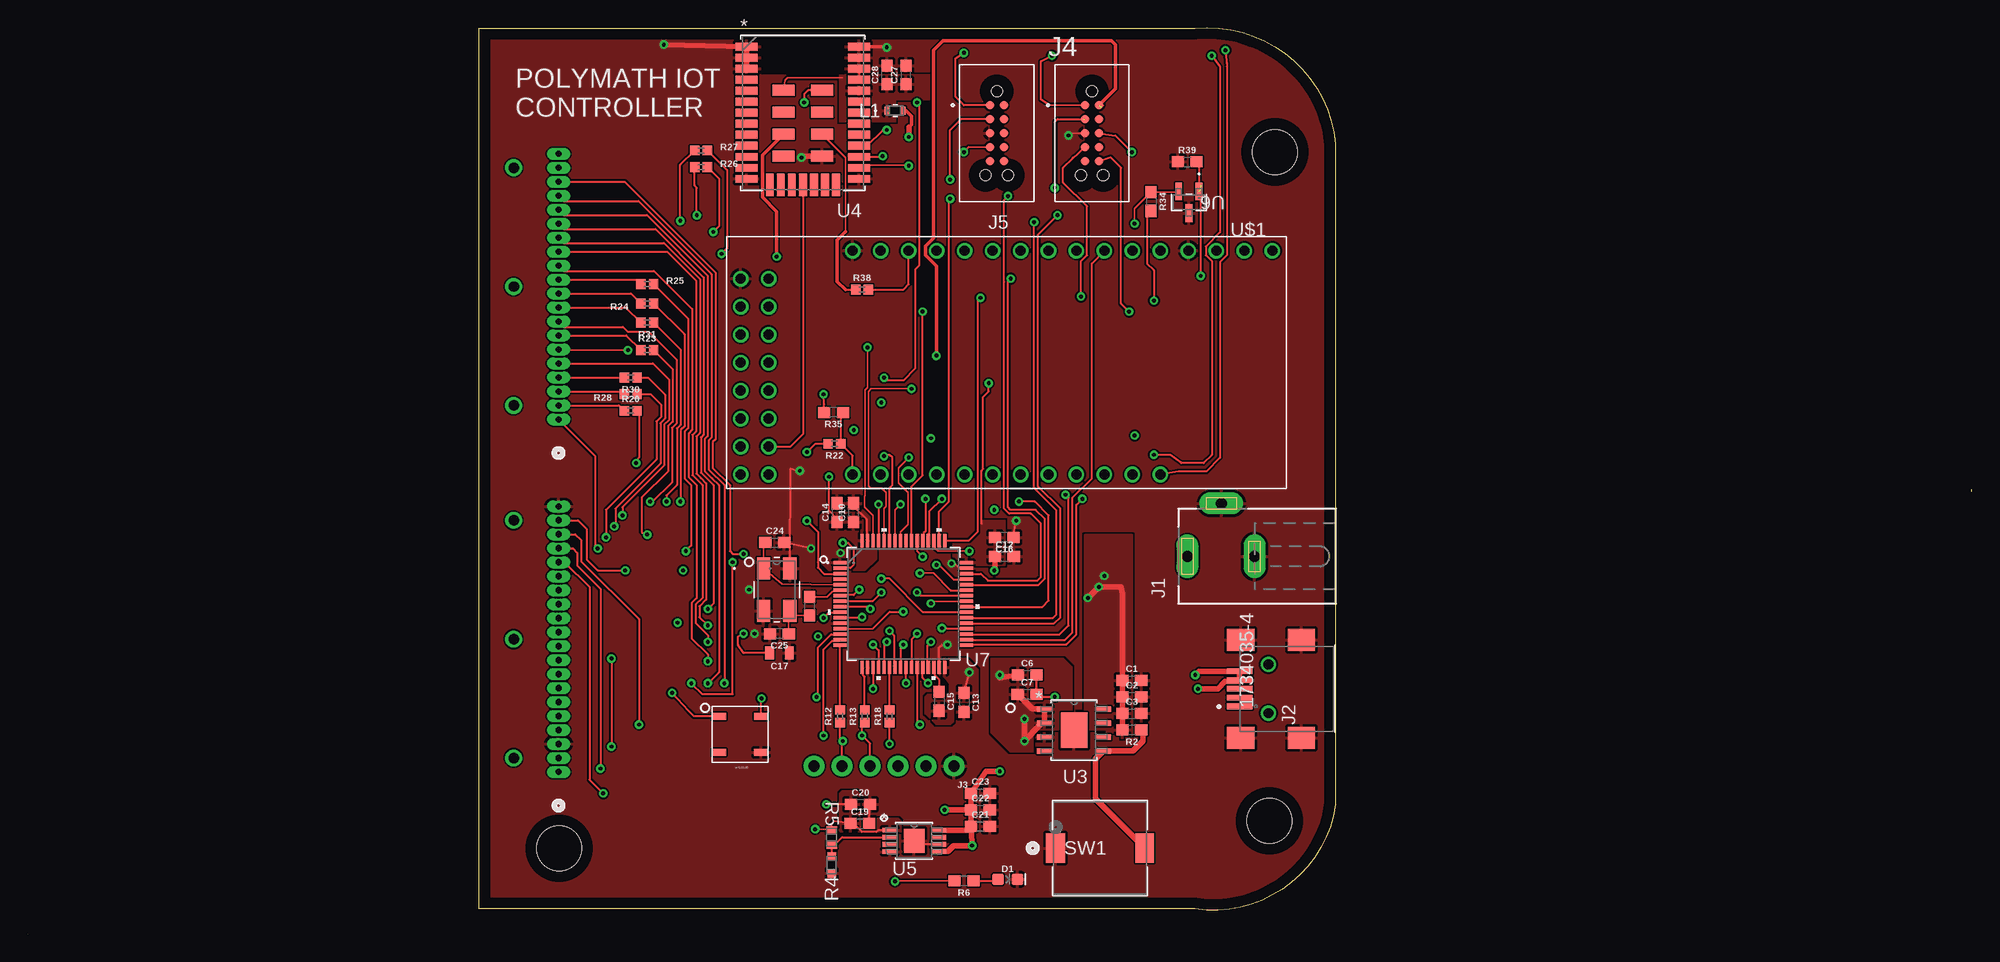
[diagram p7: board, top side]
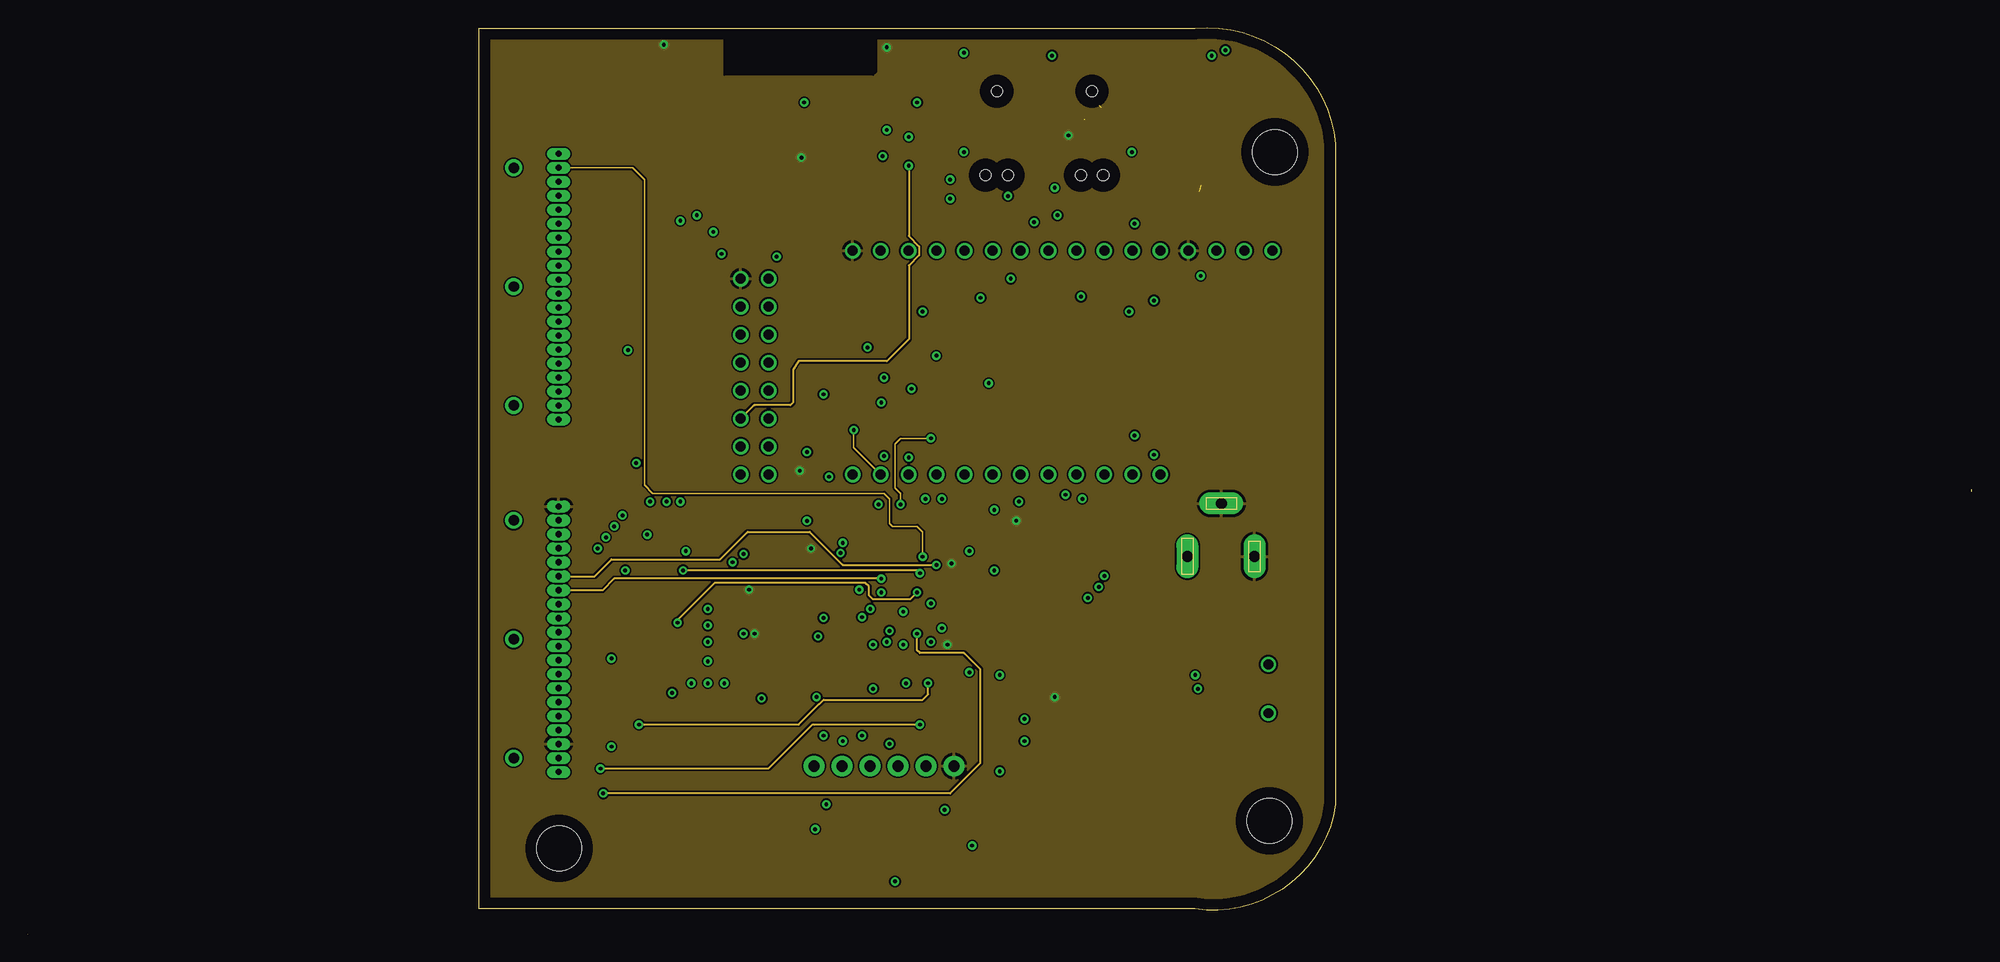
[diagram p8: board, inner layer Route2]
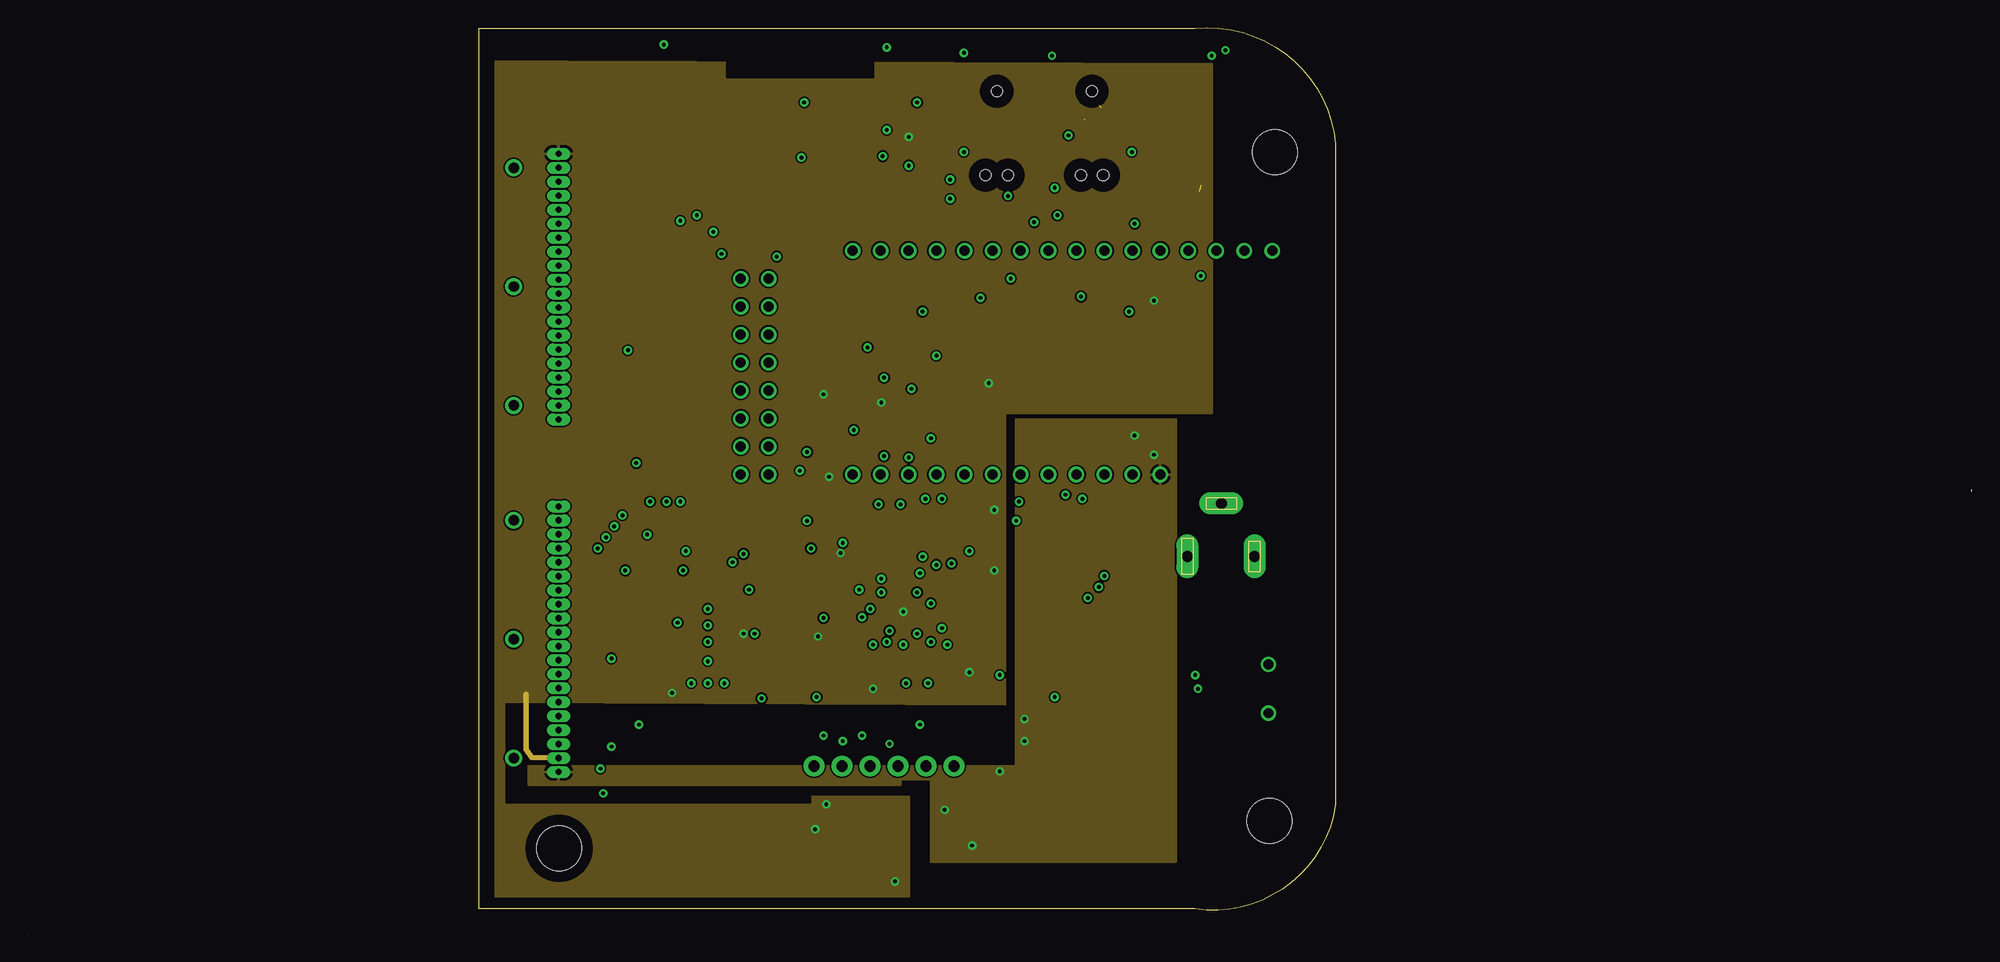
[diagram p9: board, inner layer Route15]
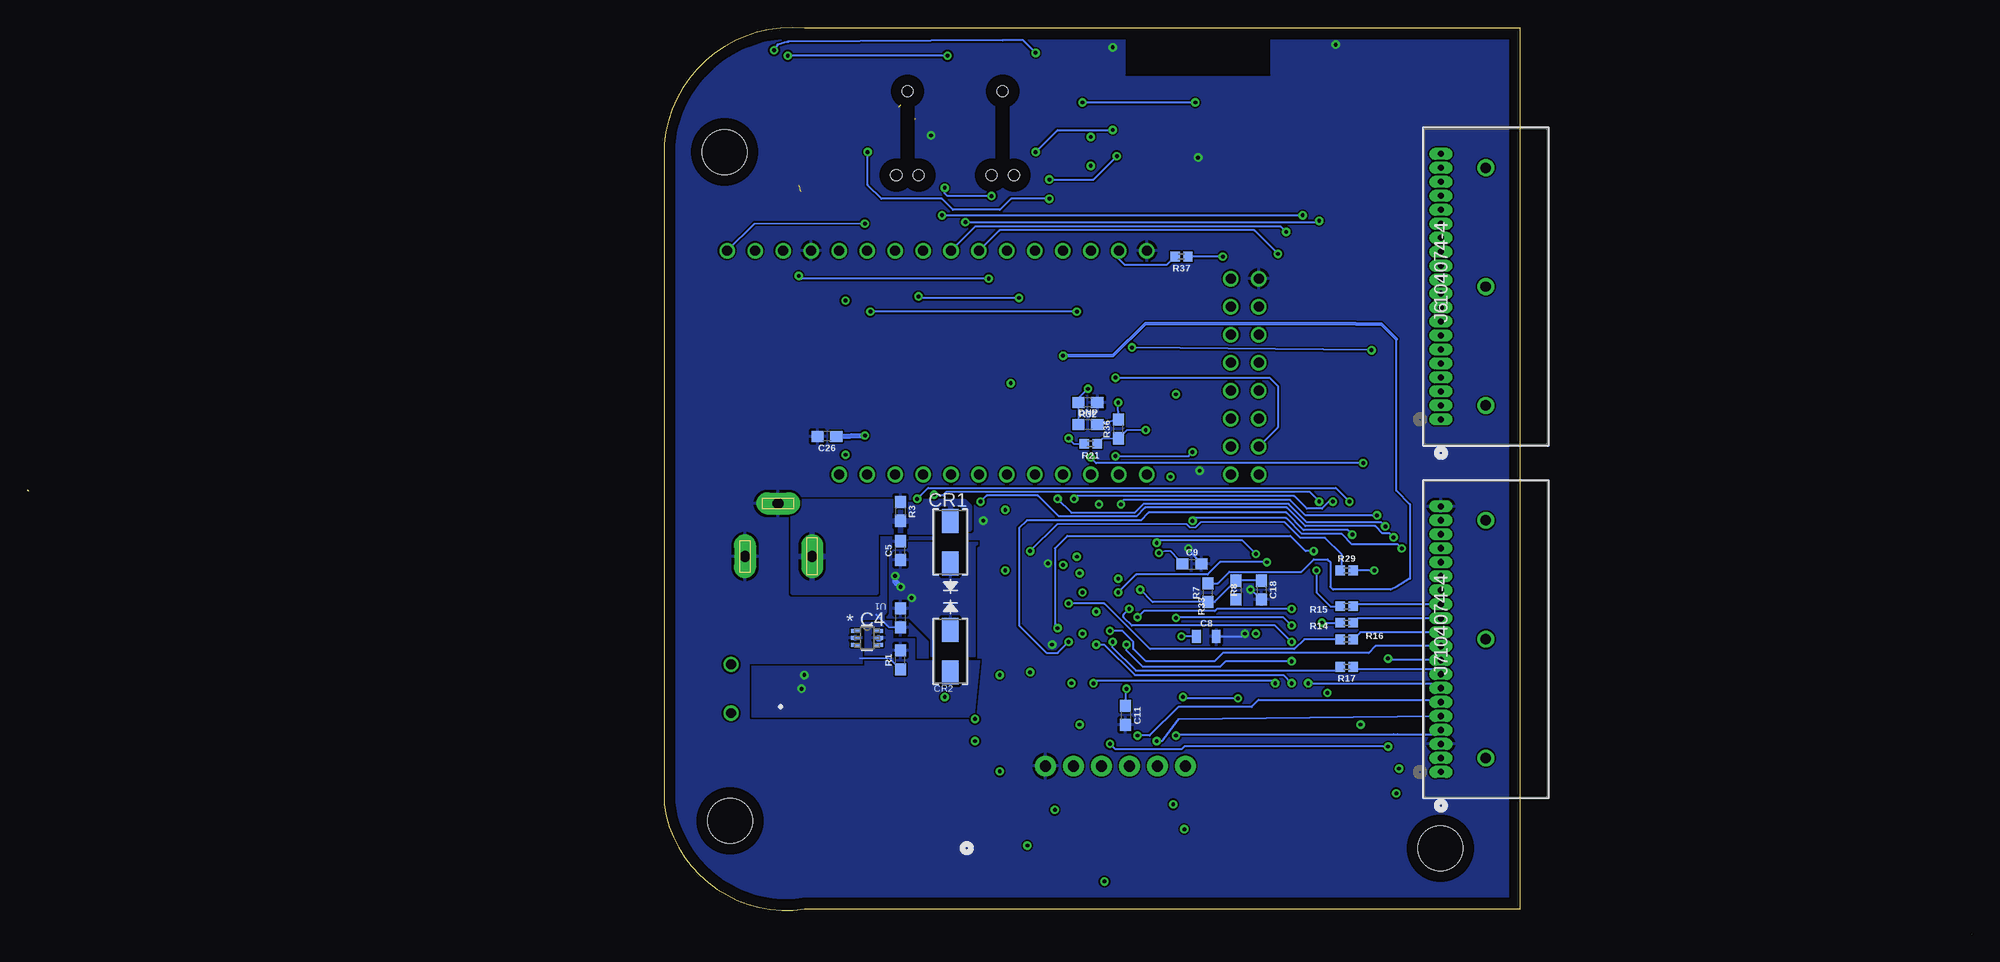
[diagram p10: board, bottom side, seen from below]

Size 176.55 x 82.34 mm. Coordinates in mm from the lower left corner, seen from the top.
Outline: 0,0 arc23 0.02,0
Outline: 176.52,40.25 arc180 176.5,40.33
Outline: 176.47,40.29 arc180 176.55,40.29
Outline: 106.02,2.29 41.02,2.29 41.02,82.29 106.02,82.29 arc-90 118.77,71.79 118.77,11.79 arc-90 106.02,2.29
Copper layers (1+2*15+16): Top 0.035mm / dielectric 0.31mm / Route2 0.035mm / dielectric 0.73mm / Route15 0.035mm / dielectric 0.31mm / Bottom 0.035mm
Design rules "default *": minimum track width 6mil, minimum drill 0.35mm, track to track 6mil, track to pad 6mil, pad to pad 6mil, via to via 6mil, smd to smd 6mil, copper to edge 40mil, drill to drill 6mil, minimum pad ring 10mil, minimum via ring 8mil, stop-mask expansion 4mil, vias tented up to drill 0mil, thermal gap 10mil
Holes 4.06 mm at 113.27,71.04 112.77,10.29 48.27,7.79

### Footprints (pad centres in the part's own frame; a part is rotated, then mirrored left to right if it is on the bottom)
0603 = smd 1.1 x 1: 1 -0.85,0; 2 0.85,0
0805 = smd 0.8 x 1.2: 1 -0.9,0; 2 0.9,0
DIODE_DO214BA = smd 2.184 x 1.524: 1 -1.93,0; 2 1.93,0
CRYSTAL_TXC_7B = smd 1.194 x 2.007: 1 -1.194,1.943; 2 -1.194,-1.943; 3 1.194,-1.943; 4 1.194,1.943
LED-0603 = smd 1 x 1: A -0.877,0; C 0.877,0
DCJ0202 = drill 1 pad 2 long: 1 0,3.1; 2 4.8,0; 3 0,-3
CONN5_USB1734035_TEC = smd 0.508 x 2.311: 1 -1.6,4.461; 2 -0.8,4.461; 3 0,4.461; 4 0.8,4.461; 5 1.6,4.461 | smd 2.007 x 2.489: 6 -4.45,4.366; 7 4.45,4.366; 8 -4.45,-1.145; 9 4.45,-1.145 | drill 0.889 pad 0.889: 10 -2.21,1.854; 11 2.21,1.854
1X06_NO_SILK = drill 1.016 pad 1.88: 1 0,0; 2 2.54,0; 3 5.08,0; 4 7.62,0; 5 10.16,0; 6 12.7,0
TAG-CONNECT_TC2050-IDC-NL = smd 0.787 x 0.787: 1 0,0; 2 0,-1.27; 3 0,-2.54; 4 0,-3.81; 5 0,-5.08; 6 1.27,-5.08; 7 1.27,-3.81; 8 1.27,-2.54; 9 1.27,-1.27; 10 1.27,0 | hole 0.991: 1.65,-6.35; -0.38,-6.35; 0.635,1.27
CONN20_104074_28P7X11P18_TEC = drill 0.559 pad 0.889 long: 1 0,0; 2 1.27,0; 3 2.54,0; 4 3.81,0; 5 5.08,0; 6 6.35,0; 7 7.62,0; 8 8.89,0; 9 10.16,0; 10 11.43,0; 11 12.7,0; 12 13.97,0; 13 15.24,0; 14 16.51,0; 15 17.78,0; 16 19.05,0; 17 20.32,0; 18 21.59,0; 19 22.86,0; 20 24.13,0 | drill 0.94 pad 1.524: 21 1.27,-4.064; 22 22.86,-4.064; 23 12.065,-4.064
IND_1608_TDK-L = smd 0.452 x 0.749: 1 -0.726,0; 2 0.726,0
RC0603N_VIS = smd 0.756 x 0.8: 1 -0.778,0; 2 0.778,0
RES_CRCW_0603 = smd 0.711 x 0.94: 1 -0.673,0; 2 0.673,0
0402 = smd 0.85 x 0.9: 1 -0.58,0; 2 0.58,0
SW_TL9320_EWI = smd 1.702 x 2.692: 1 -4.051,0; 2 4.051,0
SOIC6_SC70_1P35X2P2_ONS = smd 0.838 x 0.356: 1 -1.041,0.65; 2 -1.041,0; 3 -1.041,-0.65; 4 1.041,-0.65; 5 1.041,0; 6 1.041,0.65
HTSOP-J8_ROM = smd 1.372 x 0.483: 1 -2.667,1.905; 2 -2.667,0.635; 3 -2.667,-0.635; 4 -2.667,-1.905; 5 2.667,-1.905; 6 2.667,-0.635; 7 2.667,0.635; 8 2.667,1.905 | smd 2.413 x 3.2: EPAD 0,0
SMD41_13P9X11_SIL = smd 2.007 x 0.711: 1 -5.1,6; 2 -5.1,5; 3 -5.1,4; 4 -5.1,3; 5 -5.1,2; 6 -5.1,1; 7 -5.1,0; 8 -5.1,-1; 9 -5.1,-2; 10 -5.1,-3; 11 -5.1,-4; 12 -5.1,-5; 13 -5.1,-6; 21 5.1,-6; 22 5.1,-5; 23 5.1,-4; 24 5.1,-3; 25 5.1,-2; 26 5.1,-1; 27 5.1,0; 28 5.1,1; 29 5.1,2; 30 5.1,3; 31 5.1,4; 32 5.1,5; 33 5.1,6 | smd 0.711 x 2.007: 14 -3,-6.55; 15 -2,-6.55; 16 -1,-6.55; 17 0,-6.55; 18 1,-6.55; 19 2,-6.55; 20 3,-6.55 | smd 2.007 x 0.991: 34 -1.75,2.047; 35 1.75,2.047; 36 -1.75,0.047; 37 1.75,0.047; 38 -1.75,-1.953; 39 1.75,-1.953; 40 -1.75,-3.953; 41 1.75,-3.953
SOIC_01DGNR_TEX = smd 1.333 x 0.432: 1 -2.216,0.975; 2 -2.216,0.325; 3 -2.216,-0.325; 4 -2.216,-0.975; 5 2.216,-0.975; 6 2.216,-0.325; 7 2.216,0.325; 8 2.216,0.975 | smd 1.854 x 2.159: EPAD 0,0
SOT-23_2P9X1P3_DIO-M = smd 0.61 x 1.626: 1 -0.915,-0.991; 2 0.915,-0.991; 3 0,0.991
LQFP64-10X10MM = smd 1.194 x 0.305: 1 -5.75,3.75; 2 -5.75,3.25; 3 -5.75,2.75; 4 -5.75,2.25; 5 -5.75,1.75; 6 -5.75,1.25; 7 -5.75,0.75; 8 -5.75,0.25; 9 -5.75,-0.25; 10 -5.75,-0.75; 11 -5.75,-1.25; 12 -5.75,-1.75; 13 -5.75,-2.25; 14 -5.75,-2.75; 15 -5.75,-3.25; 16 -5.75,-3.75; 33 5.75,-3.75; 34 5.75,-3.25; 35 5.75,-2.75; 36 5.75,-2.25; 37 5.75,-1.75; 38 5.75,-1.25; 39 5.75,-0.75; 40 5.75,-0.25; 41 5.75,0.25; 42 5.75,0.75; 43 5.75,1.25; 44 5.75,1.75; 45 5.75,2.25; 46 5.75,2.75; 47 5.75,3.25; 48 5.75,3.75 | smd 0.305 x 1.194: 17 -3.75,-5.75; 18 -3.25,-5.75; 19 -2.75,-5.75; 20 -2.25,-5.75; 21 -1.75,-5.75; 22 -1.25,-5.75; 23 -0.75,-5.75; 24 -0.25,-5.75; 25 0.25,-5.75; 26 0.75,-5.75; 27 1.25,-5.75; 28 1.75,-5.75; 29 2.25,-5.75; 30 2.75,-5.75; 31 3.25,-5.75; 32 3.75,-5.75; 49 3.75,5.75; 50 3.25,5.75; 51 2.75,5.75; 52 2.25,5.75; 53 1.75,5.75; 54 1.25,5.75; 55 0.75,5.75; 56 0.25,5.75; 57 -0.25,5.75; 58 -0.75,5.75; 59 -1.25,5.75; 60 -1.75,5.75; 61 -2.25,5.75; 62 -2.75,5.75; 63 -3.25,5.75; 64 -3.75,5.75
QUICKLOGIC = drill 0.9: QUICKLOGIC1 -10.16,22.86; QUICKLOGIC2 -10.16,20.32; QUICKLOGIC3 -10.16,17.78; QUICKLOGIC4 -10.16,15.24; QUICKLOGIC5 -10.16,12.7; QUICKLOGIC6 -10.16,10.16; QUICKLOGIC7 -10.16,7.62; QUICKLOGIC8 -10.16,5.08; QUICKLOGIC9 -10.16,2.54; QUICKLOGIC10 -10.16,0; QUICKLOGIC11 -10.16,-2.54; QUICKLOGIC12 -10.16,-5.08; QUICKLOGIC13 -10.16,-7.62; QUICKLOGIC14 -10.16,-10.16; QUICKLOGIC15 -10.16,-12.7; QUICKLOGIC16 -10.16,-15.24; QUICKLOGIC17 10.16,12.7; QUICKLOGIC19 10.16,-15.24; QUICKLOGIC20 10.16,-12.7; QUICKLOGIC21 10.16,-10.16; QUICKLOGIC22 10.16,-7.62; QUICKLOGIC23 10.16,-5.08; QUICKLOGIC24 10.16,-2.54; QUICKLOGIC25 10.16,0; QUICKLOGIC26 10.16,2.54; QUICKLOGIC27 10.16,5.08; QUICKLOGIC28 10.16,7.62; QUICKLOGIC29 10.16,10.16; QUICKLOGIC30 -7.62,-22.86; QUICKLOGIC31 -5.08,-22.86; QUICKLOGIC32 -2.54,-22.86; QUICKLOGIC33 0,-22.86; QUICKLOGIC34 2.54,-22.86; QUICKLOGIC35 5.08,-22.86; QUICKLOGIC36 7.62,-22.86; QUICKLOGIC37 10.16,-22.86; QUICKLOGIC38 -7.62,-25.4; QUICKLOGIC39 -5.08,-25.4; QUICKLOGIC40 -2.54,-25.4; QUICKLOGIC41 0,-25.4; QUICKLOGIC42 2.54,-25.4; QUICKLOGIC43 5.08,-25.4; QUICKLOGIC44 7.62,-25.4; QUICKLOGIC45 10.16,-25.4
WS2812B = smd 1.27 x 0.635: 1 -1.9,1.626; 2 -1.9,-1.626; 3 1.9,-1.626; 4 1.9,1.626

### Placement (x,y rotation side)
C1  100.27,23.04 0 top
C2  100.27,21.54 0 top
C3  100.27,20.04 0 top
C4  97.3,28.72 270 bottom
C5  97.3,34.84 90 bottom
C6  90.77,23.54 0 top
C7  90.76,21.8 0 top
C8  69.52,27.04 0 bottom
C9  70.82,33.61 0 bottom
C10  75.02,38.29 90 top
C11  76.84,19.87 270 bottom
C12  88.7,34.3 0 top
C13  85.03,21.05 270 top
C14  73.52,38.29 90 top
C15  82.76,21.15 270 top
C16  88.69,36.05 180 top
C17  68.27,25.54 180 top
C18  64.52,31.26 270 bottom
C19  75.57,10.05 0 top
C20  75.63,11.8 0 top
C21  86.52,9.79 0 top
C22  86.52,11.29 0 top
C23  86.52,12.79 0 top
C24  67.84,35.57 0 top
C25  68.27,27.29 180 top
C26  103.97,45.22 180 bottom
C27  79.77,78.04 90 top
C28  78.02,78.04 90 top
CR1  92.76,35.61 90 bottom
CR2  92.76,25.7 270 bottom
CR3  68.02,31.29 0 top
D1  89,4.99 0 top
DNP  80.27,46.29 0 bottom
J1  108.4,34.32 90 top
J2  114.52,22.29 90 top
J3  84.12,15.27 180 top
J4  96.02,75.29 0 top
J5  87.37,75.29 0 top
J6  48.21,46.75 90 bottom
J7  48.21,14.73 90 bottom
L1  78.77,74.79 0 top
R1  97.3,24.91 90 bottom
R2  100.27,18.54 180 top
R3  97.3,38.4 270 bottom
R4  73.02,6.29 90 top
R5  73.02,8.79 270 top
R6  85.03,4.84 180 top
R7  69.36,31.01 90 bottom
R8  66.82,31.26 270 bottom
R12  73.77,19.79 90 top
R13  76.02,19.79 90 top
R14  56.77,28.29 180 bottom
R15  56.77,29.79 180 bottom
R16  56.77,26.79 180 bottom
R17  56.77,24.29 180 bottom
R18  78.27,19.79 90 top
R20  54.77,47.54 0 top
R21  80.02,44.54 180 bottom
R22  73.27,44.54 180 top
R23  56.27,53.04 0 top
R24  56.27,57.29 0 top
R25  56.27,59.04 0 top
R26  61.16,69.66 0 top
R27  61.16,71.18 0 top
R28  54.77,49.04 180 top
R29  56.77,33.04 0 bottom
R30  54.77,50.54 180 top
R31  56.27,55.54 180 top
R32  80.27,48.29 180 bottom
R33  71.02,29.79 90 top
R34  102.02,66.54 270 top
R35  73.18,47.39 180 top
R36  77.49,45.89 90 bottom
R37  71.77,61.54 180 bottom
R38  75.77,58.54 0 top
R39  105.3,70.14 0 top
SW1  97.39,7.82 0 top
U1  100.32,26.91 0 bottom
U3  95.02,18.54 0 top
U4  70.4,74.6 0 top
U5  80.51,8.48 0 top
U6  105.45,66.47 180 top
U7  79.52,29.99 0 top
U$1  90.16,51.91 270 top
U$2  64.7,18.16 0 top

### Tracks (layer width: path | path; a pad name or v marks a point on that pad's centre or on a via)
0  (via drill 0.35)
  Top 0.152: J4.3 94.73,72.75 v94.52,72.54
  Top 0.2: C10.2 75.02,38.85 76.17,37.69 76.17,35.83 U7.63 | U4.31 U4.30 | C19.2 C20.2 | 89.25,36.05 C16.1 v89.77,37.56 | 70.02,42.04 v70.12,42.08 | v70.12,42.08 70.27,42.16 | v71.14,35.04 C24.2 | CR3.4 69.27,42.29 v70.12,42.08 | C6.2 C7.2 91.87,21.54 v93.27,21.54 | U7.47 84.57,33.24 84.02,33.79 v83.9,33.67 v83.9,33.66 | U7.31 82.77,26.04 83.02,26.29 v83.52,26.29 | U5.6 80.83,8.15 U5.EPAD
  Top 0.3: U4.33 77.96,80.6 v78.02,80.54
  Top 0.5: U4.3 U4.1 v57.77,80.79 | U4.41 70.38,70.65 v70.27,70.54
  Bottom 0.152: R1.1 98.28,25.04 101.02,25.04 | C4.2 98.35,27.87 99.52,29.04
  Bottom 0.2: 64.14,30.79 C18.2 v65.52,31.29 | C9.2 v71.14,35.04 | C8.2 66.27,27.04 v66.02,27.29
  pour Top (rank 2): 108.02,2.29 41.02,2.29 41.02,82.14 40.87,82.29 107.27,82.29 arc-90 118.77,70.79 118.77,13.04 arc-90
  pour Bottom (rank 2): 108.02,2.29 41.02,2.29 41.02,82.29 107.27,82.29 arc-90 118.77,70.79 118.77,13.04 arc-90
  pour Route2 (rank 2): 107.77,2.29 41.02,2.29 41.02,82.29 107.27,82.29 arc-90 118.77,70.79 118.77,13.29 arc-90
3V3  (via drill 0.35)
  Top 0.2: C14.1 73.52,37.73 72.77,38.48 72.77,39.79 72.77,39.8 v72.77,41.54 | R35.2 72.33,48.1 v72.27,49.04 | R34.2 101.65,65.32 101.65,60.92 102.27,60.31 v102.27,57.54 | C17.2 65.02,25.54 64.52,26.29 64.52,27.04 v65.02,27.29 | U$2.1 60.52,19.79 60.02,20.29 v58.52,21.92 | R6.2 v78.77,4.79 | U5.1 77.23,9.45 77.07,9.3 75.76,9.3 75.01,10.05 | 75.01,10.05 C19.1 | 75.01,10.05 73.27,10.29 73.02,10.04 R5.1 v71.52,9.54 | C20.1 v72.52,11.79 | U7.13 76.77,27.79 78.27,29.29 v79.52,29.29 | U7.19 v76.77,22.29 | v87.27,50.04 87.27,49.29 86.77,48.79 86.77,42.25 86.62,42.1 86.62,37.27 | C13.1 v85.52,23.79
  Top 0.3: L1.2 79.77,74.79 80.27,74.29 80.27,73.54 80.02,73.29
  Top 0.5: 80.02,73.29 v80.02,72.41 | C12.1 87.85,33.12 v87.77,33.04
  Route15 0.5: J7.2 45.77,16.04 45.27,16.79 45.27,21.79
  Bottom 0.152: C9.1 72.64,34.65 72.77,34.79 73.27,34.79 v73.82,34.63
  Bottom 0.2: R36.2 77.49,46.79 | 77.49,46.79 v77.52,48.29 | DNP.2 77.49,46.79 | C11.1 v76.77,22.29 | C8.1 v71.77,27.04
  other vias: 87.77,38.54
  pour Top: 79.27,9.29 73.77,9.29 73.77,12.79 74.02,13.04 75.27,13.04 75.52,12.79 75.52,10.54 79.02,10.54 79.27,10.29
  pour Top: 72.27,38.29 76.77,38.29 77.02,38.04 77.02,34.04 76.02,33.04 74.27,33.04 72.77,33.04 72.52,33.29 72.02,33.79 72.02,34.04 72.02,38.04
  pour Top: 83.02,25.04 85.27,25.04 86.27,24.04 86.27,21.29 86.02,21.04 84.02,21.04 84.02,19.29 83.77,19.04 82.52,19.04 81.52,20.04 81.52,21.54 81.77,21.79 83.77,21.79 83.77,22.79 83.52,23.04 83.02,23.54
  pour Top: 84.52,33.54 88.77,33.54 88.77,37.54 84.02,37.54 84.02,34.04
  pour Route15: 49.02,79.29 107.52,79.04 107.52,47.29 88.77,47.29 88.77,20.82 43.27,21.04 43.27,11.79 71.27,11.79 71.27,12.54 80.02,12.54 80.02,3.04 42.52,3.04 42.52,79.29
3V3_BT
  Top 0.152: U4.34 68.77,77.54 69.02,77.79 74.02,77.79
  pour Top: 73.77,78.04 82.77,78.04 82.77,75.79 78.77,75.79 78.77,73.79 73.77,73.79
5V0  (via drill 0.35)
  Top 0.152: J4.1 92.77,75.29
  Top 0.2: 92.77,75.29 92.02,75.79 92.02,79.29 v93.02,79.79 | v102.27,43.54 103.77,43.54 104.77,42.79 106.77,42.79 107.52,43.54 107.52,61.14 106.98,61.67 106.98,62.46 108.27,63.75 108.27,78.79 v107.52,79.79 | J5.1 85.02,75.29 84.27,76.04 84.27,79.54 v85.02,80.04 | 108.89,79.16 108.89,78.79 | 108.89,78.79 108.89,61.67 108.27,61.05 108.27,43.29 107.02,42.04 104.52,42.04 U$1.QUICKLOGIC17 | v108.77,80.29 108.89,78.79
  Top 0.5: U5.8 85.33,9.45 C21.1 | C21.1 C23.1 87.02,14.79 v88.27,14.79 | C22.1 v83.27,11.29 | C21.1 85.75,8.3 v85.77,8.05 v85.77,8.04 84.06,8.04 83.56,7.54 82.76,7.54 U5.5 | C6.1 88.27,23.29 v88.27,23.54 | C7.1 91.26,20.44 U3.1 U3.2 92.13,19.17 91.26,18.31 91.26,18.28 v90.52,17.54 v90.52,19.54
  Bottom 0.2: v85.02,80.04 86.15,81.17 88.02,81.17 107.47,81.05 107.56,81.04 108.45,80.8 v108.77,80.29 | v93.02,79.79 v107.52,79.79
  Bottom 0.5: C26.1 v100.52,45.29
  pour Route15: 89.77,15.29 89.77,46.79 104.27,46.79 104.27,6.54 82.02,6.54 82.02,14.04 79.27,14.04 79.27,13.54 45.52,13.54 45.52,15.29
  pour Top: 87.77,25.04 94.02,25.04 94.77,24.29 94.77,19.04 94.27,18.54 91.27,18.54 91.27,16.54 89.27,16.54 89.02,16.79 87.52,18.29 87.52,25.04
ANALOG_INPUT_1  (via drill 0.35)
  Top 0.2: U7.15 73.67,26.64 73.07,26.64 72.27,25.84 v72.27,18.04
  Bottom 0.2: v72.27,18.04 72.14,18.16 52.52,18.16 52.14,18.16 48.58,18.16 J7.4
ANALOG_INPUT_2  (via drill 0.35)
  Top 0.2: J6.12 48.69,60.23 56.88,60.23 60.35,56.77 60.35,45.82 60.02,45.49 60.02,41.54 60.77,40.79 60.77,30.54 60.31,30.08 60.31,26.85 61.77,25.4 v61.77,24.79 | U7.20 77.27,25.04 77.27,25.29 77.27,25.79 v76.77,26.29
  Bottom 0.2: v61.77,24.79 67.76,24.79 68.11,24.44 68.12,24.44 68.27,24.29 75.27,24.29 76.77,25.79 v76.77,26.29
ANALOG_INPUT_3  (via drill 0.35)
  Top 0.2: J6.13 58.07,61.99 60.7,59.36 60.7,45.67 60.37,45.35 60.37,41.68 61.27,40.79 61.27,30.54 60.67,29.93 60.67,28.25 61.77,27.15 v61.77,26.54 | v76.52,29.54 76.32,29.74 U7.9
  Bottom 0.2: v61.77,26.54 63.27,28.04 76.27,28.04 77.02,28.79 77.02,29.04 v76.52,29.54
ANALOG_INPUT_4  (via drill 0.35)
  Top 0.2: J6.14 48.69,62.77 57.78,62.77 61.05,59.51 61.05,45.52 60.72,45.2 60.72,41.83 61.14,41.41 61.62,40.93 61.62,30.39 61.02,29.79 61.02,28.79 v61.77,28.04 | v72.27,28.73 72.78,29.24 U7.10
  Bottom 0.2: v72.27,28.73 72.21,28.79 62.52,28.79 v61.77,28.04
ANALOG_INPUT_5  (via drill 0.35)
  Top 0.2: J6.15 48.69,64.04 57.01,64.04 61.4,59.65 61.4,45.38 61.14,45.12 61.14,41.91 62.27,40.79 62.27,30.04 v61.77,29.54 | v75.77,28.79 75.72,28.74 U7.11
  Bottom 0.2: v61.77,29.54 68.57,29.54 68.75,29.36 75.2,29.36 v75.77,28.79
ANALOG_INPUT_6  (via drill 0.35)
  Top 0.2: v78.27,27.54 78.67,27.13 78.67,24.33 U7.23
  Bottom 0.2: J7.10 54.15,26.16 54.77,25.54 68.02,25.54 68.77,24.79 75.02,24.79 76.14,25.91 76.14,26.55 77.13,27.54 v78.27,27.54
ANALOG_INPUT_7  (via drill 0.35)
  Top 0.2: J7.16 48.78,33.78 51.02,31.54 51.02,14.04 v52.27,12.79 | v80.77,27.29 80.27,26.79 U7.26
  Route2 0.2: v52.27,12.79 83.77,12.79 86.52,15.54 86.52,24.04 85.02,25.54 81.02,25.54 80.77,25.79 v80.77,27.29
ANALOG_INPUT_8  (via drill 0.35)
  Top 0.2: v60.27,22.79 61.27,21.79 64.02,21.79 v64.02,33.79 | U7.8 76.72,30.24 v77.52,31.04
  Bottom 0.2: v60.27,22.79 48.65,22.79 J7.7 | v64.02,33.79 68.27,33.79 69.4,32.66 75.9,32.66 v77.52,31.04
ANT
  cutout Route15: 63.52,81.79 76.52,81.79 76.77,81.54 76.77,77.79 63.52,77.79
  cutout Route2: 63.27,82.29 77.02,82.29 77.02,78.29 76.77,78.04 63.27,78.04
ANTENNA
  cutout Bottom: 63.77,81.93 76.77,81.93 76.77,78.04 63.77,78.04
BOOT0  (via drill 0.35)
  Top 0.152: U7.60 77.77,38.68 77.94,38.85 77.94,40.12 77.52,40.54 76.52,40.54 76.35,40.71 76.35,49.29 76.6,49.54 v80.27,49.54
  Bottom 0.152: v80.27,49.54 81.12,48.69 R32.2 DNP.1
BT_BOOT0  (via drill 0.35)
  Top 0.2: U4.35 70.88,76.65 70.52,76.29 v70.52,75.54 | v80.77,75.54 80.95,75.35 80.95,60.73 80.6,60.37 80.6,51.37 79.52,50.29 78.02,50.29 v77.77,50.54
  Bottom 0.2: v70.52,75.54 v80.77,75.54 | v77.77,50.54 63.77,50.54 63.02,49.79 63.02,46.03 U$1.QUICKLOGIC44
BT_GPIO
  Top 0.2: U4.17 70.4,45.42 69.27,44.29 U$1.QUICKLOGIC36
BT_RESET  (via drill 0.35)
  Top 0.2: v80.02,69.79 75.76,69.86 U4.22
  Route2 0.2: U$1.QUICKLOGIC43 65.97,48.04 66.02,48.04 69.27,48.04 69.52,48.29 69.52,51.29 70.02,52.04 78.02,52.04 79.77,53.79 80.02,54.04 80.02,60.74 80.95,61.67 80.95,62.46 80.02,63.4 v80.02,69.79
BT_SWCLK  (via drill 0.35)
  Top 0.152: J5.4 85.46,71.48
  Top 0.2: v78.02,73.04 77.65,73.04 76.21,71.6 U4.24 | 85.46,71.48 v85.02,71.04
  Bottom 0.2: v85.02,71.04 83.02,73.04 v78.02,73.04
BT_SWDIO  (via drill 0.35)
  Top 0.2: U4.23 77.46,70.6 77.52,70.54 v77.64,70.66 | v83.77,68.54 83.77,73.04 84.75,74.02 J5.2
  Bottom 0.2: v83.77,68.54 79.77,68.54 v77.64,70.66
BT_UART_RX  (via drill 0.35)
  Top 0.3: v68.02,61.54 68.02,65.64 66.74,66.92 66.74,70.74 U4.38
  Bottom 0.2: v68.02,61.54 R37.1
BT_UART_TX
  Top 0.152: 74.24,70.55 74.27,70.53 74.27,68.15 74.27,63.79
  Top 0.2: U4.39 74.24,70.55 | 74.27,58.54 R38.1
  Top 0.3: 74.27,63.79 73.52,63.04 73.52,59.29 74.27,58.54
CLUSTER_ID_1  (via drill 0.35)
  Top 0.2: v82.52,33.54 82.77,33.54 84.07,32.24 U7.45
  Route2 0.2: J7.15 51.49,32.51 53.02,34.04 62.88,34.04 65.38,36.54 71.02,36.54 74.02,33.54 v82.52,33.54
CLUSTER_ID_2  (via drill 0.35)
  Top 0.2: J6.16 48.69,65.31 56.24,65.31 61.75,59.8 61.75,45.23 61.5,44.97 61.5,42.06 62.16,41.39 62.77,40.79 62.77,23.79 v61.77,22.79 | v79.52,26.29 79.27,26.04 U7.24
  Bottom 0.2: v61.77,22.79 62.52,23.54 76.02,23.54 78.77,26.29 v79.52,26.29
CLUSTER_ID_3  (via drill 0.35)
  Top 0.2: J6.17 48.69,66.58 55.47,66.58 62.11,59.94 62.11,45.09 61.85,44.83 61.85,42.21 63.27,40.79 v63.27,22.79 | v79.77,22.79 U7.25
  Bottom 0.2: v79.77,22.79 79.52,23.04 63.52,23.04 v63.27,22.79
FREQ_INPUT_1  (via drill 0.35)
  Top 0.2: U7.39 81.32,29.24 78.27,32.29 v77.52,32.29
  Route2 0.2: v77.52,32.29 53.27,32.29 52.22,31.24 J7.14
FREQ_INPUT_2  (via drill 0.35)
  Top 0.2: v52.02,15.04 52.02,31.36 49.92,33.47 49.92,34.64 49.52,35.04 J7.17 | U7.27 80.77,19.29 v81.02,19.04
  Route2 0.2: v52.02,15.04 67.27,15.04 71.27,19.04 v81.02,19.04
I2C3_SCL
  Bottom 0.2: J7.11 55.55,27.43 R16.1
I2C3_SDA
  Top 0.2: J6.3 53.94,49.29 R28.2
INPUT_1  (via drill 0.35)
  Top 0.2: v54.02,38.04 54.02,38.79 57.81,42.58 57.81,46.27 58.23,46.69 58.23,50.39 56.79,51.83 J6.5 | v77.27,39.04 U7.61
  Bottom 0.2: v54.02,38.04 60.52,38.04 61.92,39.44 77.02,39.44 77.27,39.19 v77.27,39.04
INPUT_2  (via drill 0.35)
  Top 0.152: v76.27,53.29 76.27,49.64 76.04,49.41 76.04,39.81 76.02,39.79 76.02,38.79 76.77,38.04 U7.62
  Top 0.2: J6.6 v54.52,53.04
  Bottom 0.2: v54.52,53.04 v76.27,53.29
INPUT_4  (via drill 0.35)
  Top 0.2: J6.18 54.21,68.34 62.46,60.09 62.46,44.94 62.2,44.68 62.2,42.36 63.77,40.79 63.77,34.79 64.02,34.54 v65.02,34.54 | v74.02,35.54 74.52,35.54 75.02,35.04 75.02,33.54 74.72,33.24 U7.2
  Bottom 0.2: v65.02,34.54 66.27,35.79 73.77,35.79 v74.02,35.54
INPUT_5  (via drill 0.35)
  Top 0.2: J6.1 51.52,43.44 51.52,35.29 v51.77,35.04 | U7.3 72.32,32.74 71.77,33.29 71.77,33.79 71.77,36.54 v70.77,37.54
  Bottom 0.2: v51.77,35.04 52.14,35.41 56.28,35.41 57.22,36.35 60.82,36.35 62.26,37.79 70.52,37.79 v70.77,37.54
LED1_DATA  (via drill 0.35)
  Top 0.2: U$2.4 66.6,21.21 66.52,21.29 v66.64,21.41 | v71.64,21.54 71.77,21.67 71.77,26.04 72.97,27.24 U7.14
  Bottom 0.2: v66.64,21.41 71.39,21.41 71.52,21.29 71.64,21.41 v71.64,21.54
N$1
  Top 0.5: R2.1 101.27,18.39 101.27,17.54 100.36,16.63 U3.5 96.97,15.92 96.97,12.28 SW1.2
N$4
  Top 0.2: R6.1 87.97,4.84 D1.A
N$5  (via drill 0.35)
  Top 0.2: v75.52,31.29 75.02,30.79 73.82,30.79 U7.7
  Bottom 0.2: C18.1 R8.1 68.77,30.16 R7.1 74.39,30.16 v75.52,31.29
N$6
  Top 0.152: R33.1 69.62,28.94 69.52,29.04 | 69.52,29.04 CR3.3 | C25.1 69.12,28.64 69.52,29.04
N$7
  Top 0.2: U7.30 82.36,24.14 82.36,23.54 82.76,23.14 C15.1
N$8
  Top 0.2: R4.2 R5.2 73.25,8.35 73.51,8.35 73.97,8.8 U5.2
N$9
  Top 0.2: R12.2 U7.16
N$11
  Top 0.2: U7.17 75.86,24.14 75.86,23.54 76.02,23.38 R13.2
N$13  (via drill 0.35)
  Top 0.2: U7.42 81.07,30.74 v80.77,31.04
  Route2 0.2: v80.77,31.04 80.14,30.41 76.76,30.41 76.39,30.78 76.39,31.56 76.03,31.92 62.4,31.92 59.02,28.54 v59.02,28.29
  Bottom 0.2: v59.02,28.29 R14.2
N$14  (via drill 0.35)
  Top 0.152: v81.02,32.79 82.27,32.79 83.82,31.24
  Top 0.2: 83.82,31.24 U7.43
  Route2 0.2: v81.02,32.79 80.77,33.04 v59.52,33.04
  Bottom 0.2: v59.52,33.04 59.52,31.04 58.27,29.79 R15.2
N$15  (via drill 0.35)
  Top 0.152: v82.02,30.04 82.22,30.24 U7.41
  Bottom 0.2: R16.2 60.63,26.79 61.52,25.89 74.62,25.89 78.77,30.04 v82.02,30.04
N$16  (via drill 0.35)
  Top 0.2: v78.02,26.54 77.77,26.29 U7.21
  Bottom 0.2: R17.2 57.7,23.94 75.92,23.94 78.02,26.04 v78.02,26.54
N$17
  Top 0.2: R18.2 U7.22
N$19  (via drill 0.35)
  Top 0.152: U7.57 79.27,36.54 79.94,37.21 79.94,40.12 79.07,40.99 79.07,42.34 79.27,42.54
  Top 0.2: R20.2 55.52,47.37 55.52,43.29 55.27,43.04 v55.27,42.79 | 79.27,42.54 v80.02,43.29
  Bottom 0.2: v55.27,42.79 79.52,42.79 v80.02,43.29
N$20  (via drill 0.35)
  Top 0.152: U7.58 78.77,38.54 v79.27,39.04
  Route2 0.152: v79.27,39.04 79.27,40.04 78.77,40.54 78.77,44.54 79.27,45.04 v82.02,45.04
  Bottom 0.152: v82.02,45.04 81.52,44.54 R21.2
N$21  (via drill 0.35)
  Top 0.2: R22.2 71.52,44.54 v70.77,43.79 | U7.59 78.27,40.54 78.52,40.79 78.52,43.29 78.27,43.54 77.89,43.54 v77.77,43.42
  Bottom 0.2: v77.77,43.42 71.14,43.42 v70.77,43.79
N$22  (via drill 0.35)
  Top 0.2: R23.2 58.58,51.3 58.58,46.55 58.17,46.13 58.17,42.04 55.77,39.64 55.77,36.54 56.02,36.29 v56.27,36.29 | U7.29 81.67,24.14 81.67,26.19 v82.02,26.54
  Bottom 0.2: v56.27,36.29 56.68,36.7 60.68,36.7 62.26,38.29 74.77,38.29 75.47,37.58 85.81,37.58 86.52,36.88 86.52,28.04 84.02,25.54 83.02,25.54 v82.02,26.54
N$23  (via drill 0.35)
  Top 0.2: R24.2 59.64,54.5 59.64,46.11 59.32,45.78 59.32,39.34 v59.27,39.29 | U7.35 93.72,27.24 94.52,28.04 94.52,39.64 v94.25,39.91
  Bottom 0.2: v94.25,39.91 93.4,39.91 93.12,40.19 60.17,40.19 v59.27,39.29
N$24  (via drill 0.35)
  Top 0.2: R25.2 59.99,55.89 59.99,45.96 59.67,45.64 59.67,41.39 60.27,40.79 60.27,35.29 v59.77,34.79 | v83.02,27.79 85.22,27.79 U7.36
  Bottom 0.2: v59.77,34.79 60.52,34.79 61.9,36.17 82.14,36.17 83.27,35.04 83.27,28.04 v83.02,27.79
N$25  (via drill 0.35)
  Top 0.2: U7.37 93.22,28.24 93.77,28.79 93.77,38.65 91.74,40.67 91.74,63.51 v93.52,65.29 | v60.77,65.29 60.77,67.79 60.58,67.98 R26.1
  Bottom 0.2: v93.52,65.29 91.66,65.29 91.65,65.29 91.13,65.29 v60.77,65.29
N$26  (via drill 0.35)
  Top 0.2: U7.38 93.12,28.74 93.42,29.04 93.42,38.5 91.39,40.53 91.39,64.42 91.27,64.54 v91.39,64.66 | v59.27,64.79 59.27,69.87 R27.1
  Bottom 0.2: v91.39,64.66 59.39,64.66 v59.27,64.79
N$27  (via drill 0.35)
  Top 0.2: R28.1 56.58,49.04 57.53,48.09 57.53,46.98 57.11,46.57 57.11,43.13 52.52,38.54 v52.52,36.04 | U7.40 92.16,29.74 92.71,30.29 92.71,38.04 91.46,39.29 v90.02,39.29
  Bottom 0.2: v52.52,36.04 52.89,36.41 53.53,36.41 54.18,37.06 60.53,37.06 62.21,38.73 75.08,38.73 75.87,37.94 82.92,37.94 84.81,39.83 89.47,39.83 v90.02,39.29
N$28  (via drill 0.35)
  Top 0.152: U7.51 82.39,35.62 82.39,35.05 82.65,34.79 v85.52,34.79
  Bottom 0.152: 62.41,37.44 70.01,37.44 70.52,36.93 71.02,36.93 71.34,37.26 83.05,37.26 v85.52,34.79
  Bottom 0.2: R29.1 57.27,33.12 57.27,34.54 58.73,36 60.97,36 62.41,37.44
N$29  (via drill 0.35)
  Top 0.2: R30.1 56.35,50.54 57.88,49.01 57.88,46.84 57.46,46.42 57.46,42.73 53.39,38.66 53.39,37.16 v53.27,37.04 | v83.02,39.54 81.87,38.39 81.87,36.45 81.77,36.35 U7.52
  Bottom 0.2: v53.27,37.04 53.64,37.41 60.39,37.41 62.06,39.08 75.22,39.08 76.02,38.29 81.77,38.29 v83.02,39.54
N$30  (via drill 0.35)
  Top 0.2: R31.1 59.29,53.1 59.29,46.25 58.96,45.93 58.96,40.8 58.02,39.86 v58.02,39.29 | U7.53 81.36,35.83 81.36,36.44 81.52,36.59 v81.52,39.54
  Bottom 0.2: v58.02,39.29 58.38,39.29 59.01,38.66 60.39,38.66 61.52,39.79 81.27,39.79 v81.52,39.54
N$31  (via drill 0.35)
  Top 0.152: U6.2 104.46,67.39 R34.1 100.52,65.89 v100.52,64.54
  Bottom 0.152: v100.52,64.54 110.55,64.54 U$1.QUICKLOGIC1
N$34
  Top 0.2: R38.2 79.52,58.54 80,59.02 U$1.QUICKLOGIC14
N$35
  Bottom 0.2: R37.2 73.1,60.79 76.93,60.79 77.46,61.32 U$1.QUICKLOGIC15
NRST  (via drill 0.35)  (1 unrouted)
  Top 0.2: 97.66,75.29 97.48,75.1
  Top 0.3: J4.10 98.77,76.77 98.77,80.79 98.43,81.12 83.1,81.12 82.27,80.29 82.27,63.22 81.53,62.49 81.53,61.65 82.52,60.67 v82.52,52.54
  Bottom 0.2: R7.2 68.48,31.86 67.42,32.91 60.9,32.91 59.77,34.04 58.52,34.04 58.27,33.79 58.27,31.54 58.02,31.29 52.77,31.29 52.27,31.54 51.02,32.29 51.02,39.04 52.27,40.29 52.27,54.04
  Bottom 0.3: v82.52,52.54 77.98,52.54 75.06,55.45 55.97,55.45 55.91,55.39 53.62,55.39 52.27,54.04
OSCIN
  Top 0.152: U7.5 68.5,31.79 CR3.1 66.82,35.4 C24.1
OSCOUT
  Top 0.152: R33.2 72.6,30.64 73.08,31.12 73.65,31.12 U7.6
OUTPUT_3  (via drill 0.35)
  Top 0.2: v55.52,19.04 55.52,28.61 50.27,33.86 50.27,35.79 49.74,36.32 J7.18 | v81.76,22.8 81.27,23.29 U7.28
  Route2 0.2: v55.52,19.04 70.02,19.04 71.89,20.91 71.9,20.91 72.28,21.29 81.27,21.29 81.77,21.79 v81.77,22.79 v81.76,22.8
OUTPUT_7  (via drill 0.35)
  Top 0.152: v81.27,34.29 80.77,34.79 U7.54
  Route2 0.152: J6.19 54.95,69.61 56.02,68.54 56.02,40.79 56.77,40.04 77.77,40.04 78.27,39.54 78.27,37.29 78.52,37.04 80.77,37.04 81.27,36.54 v81.27,34.29
QF_I2C_SCL  (via drill 0.35)
  Route2 0.152: v75.02,45.79 75.02,44.19 U$1.QUICKLOGIC20
  Bottom 0.152: R21.1 78.94,45.04 R36.1 76.74,45.79 v75.02,45.79
QF_I2C_SDA
  Top 0.2: U$1.QUICKLOGIC19 74.92,43.47 R22.1 73.85,47.21 R35.1
QF_INPUT_1
  Top 0.2: U7.34 94.22,26.74 94.87,27.39 94.87,39.64 96.63,41.4 96.63,60.92 U$1.QUICKLOGIC7
QF_MICRO_RX  (via drill 0.35)
  Top 0.2: R27.2 63.52,69.4 63.52,62.29 v63.02,61.79
  Bottom 0.2: v63.02,61.79 65.17,63.94 88.29,63.94 U$1.QUICKLOGIC10
QF_MICRO_TX  (via drill 0.35)
  Top 0.2: R26.2 62.77,68.63 62.77,64.29 v62.27,63.79
  Bottom 0.2: v62.27,63.79 62.77,64.29 90.48,64.29 U$1.QUICKLOGIC9
QF_SYS_RESET  (via drill 0.35)  (1 unrouted)
  Top 0.2: U7.44 91.81,31.74 92.36,32.29 92.36,37.7 91.52,38.54 89.27,38.54 89.02,38.79 89.02,59.29 v89.27,59.54 | v106.52,59.79 106.52,68.04 | R39.2 106.36,69.92 U6.1
  Bottom 0.2: v89.27,59.54 106.27,59.54 v106.52,59.79
SPI1_MISO  (via drill 0.35)
  Top 0.2: v53.02,25.04 v53.02,17.04 | v78.27,17.29 R18.1
  Bottom 0.2: J7.9 52.87,24.89 v53.02,25.04 | v53.02,17.04 71.52,17.04 71.77,16.79 77.77,16.79 v78.27,17.29
SPI1_MOSI
  Top 0.2: J6.2 53.71,48.02 R20.1
SPI1_SCK
  Bottom 0.2: J7.8 48.69,24.1 56,24.1 R17.1
SPI2_MISO
  Top 0.2: J6.10 54.8,58.18 R24.1
SPI2_MOSI
  Top 0.2: J6.11 55.28,59.45 R25.1
SPI2_NSS  (via drill 0.35)
  Top 0.2: J6.8 48.69,55.15 54.07,55.15 54.5,54.72 56.4,54.72 58.94,52.18 58.94,46.4 58.52,45.98 58.52,41.04 56.77,39.29 v56.52,39.29 | U7.33 85.36,26.33 94.31,26.33 95.22,27.24 95.22,38.99 v95.77,39.54
  Bottom 0.2: v95.77,39.54 94.77,40.54 57.77,40.54 v56.52,39.29
SPI2_SCK
  Top 0.2: J6.7 54.36,54.37 R23.1
SPI3_MISO
  Top 0.2: J6.4 54.17,50.56 R30.2
SPI3_MOSI
  Top 0.2: J6.9 54.32,56.91 R31.2
SPI3_SCK  (via drill 0.35)
  Top 0.2: J7.19 49.97,37.59 50.77,36.79 50.77,34.04 51.77,33.04 v54.27,33.04
  Bottom 0.2: v54.27,33.04 R29.2
SWCLK  (via drill 0.35)
  Top 0.2: U7.49 85.47,35.74 86.27,36.54 86.27,57.54 v86.52,57.79 | v95.64,57.91 95.64,61.12 96.19,61.67 96.19,66.1 94.03,68.27 94.03,69.61 94.86,70.44 | 94.86,70.44 94.97,70.55 94.99,70.55 | J4.4 94.86,70.44
  Bottom 0.2: v86.52,57.79 95.27,57.79 95.52,58.04 v95.64,57.91
SWDIO  (via drill 0.35)  (2 unrouted)
  Top 0.152: 95.92,74.04 95.94,74.02
  Top 0.2: v89.02,67.04 88.64,66.66 88.64,59.28 88.67,59.25 88.67,38.64 89.12,38.19 91.11,38.19 92.01,37.29 92.01,32.43 91.69,32.12 87.19,32.12 86.57,32.74 U7.46 | v93.27,67.79 93.27,73.79 93.52,74.04 95.9,74.04 95.92,74.02
  Bottom 0.2: v93.27,67.79 93.27,67.29 93.02,67.04 v89.02,67.04
SWO  (via drill 0.35)
  Top 0.2: U7.55 80.27,40.67 81.27,41.67 v81.27,56.54 | v100.02,56.54 99.28,57.28 99.28,69.61 98.34,70.55 J4.6
  Bottom 0.2: v81.27,56.54 v100.02,56.54
TDI  (via drill 0.35)
  Top 0.2: U7.50 82.77,38.4 83.65,39.28 83.65,66.67 v83.77,66.79 | v100.27,71.04 98.77,72.54 J4.8
  Bottom 0.2: v83.77,66.79 87.27,66.79 88.27,65.79 92.52,65.79 93.52,66.79 99.02,66.79 100.27,68.04 v100.27,71.04
UART1_MICRO_RX
  Bottom 0.2: J7.12 55.78,28.7 R14.1
UART1_MICRO_TX
  Bottom 0.2: J7.13 56.01,29.97 R15.1
UART2_MICRO_RX  (via drill 0.35)
  Top 0.2: R13.1 75.77,18.96 v75.77,18.04 76.5,17.31 J3.4
  Bottom 0.2: v75.77,18.04 74.66,18.04 72.06,20.64 65.42,20.64 64.77,21.29 48.42,21.29 J7.6
UART2_MICRO_TX  (via drill 0.35)
  Top 0.2: R12.1 73.77,17.79 v74.02,17.54 73.96,17.48 J3.5
  Bottom 0.2: v74.02,17.54 73.52,17.54 72.02,19.54 J7.5
V_ADAPTER
  pour Bottom: 91.02,36.79 91.02,38.79 91.52,39.29 107.02,39.29 107.02,31.04 99.52,31.04 99.52,36.54 91.77,36.54 91.52,36.79
V_SW  (via drill 0.35)
  Top 0.5: R2.2 C1.1 99.42,30.91 99.27,31.54 v97.27,31.54 v96.27,30.54
  Bottom 0.5: v97.77,32.54 97.77,32.04 v97.27,31.54
  pour Top: 96.02,18.54 96.02,36.29 100.27,36.29 100.27,18.04 100.02,17.79 98.27,17.79 98.02,18.04 98.02,18.54
  pour Bottom: 90.27,35.54 97.27,35.54 98.27,34.54 98.27,29.04 98.52,28.79 96.52,28.79 95.02,27.29 94.52,26.79 94.52,25.29 90.52,25.29 90.52,35.29
V_USB  (via drill 0.35)
  Top 0.5: v106.02,23.54 106.37,23.89 J2.5 J2.4 109.91,22.94 108.74,22.94 108.08,22.29 v106.27,22.29
  Bottom 0.5: 99.35,26.84 U1.5 99.21,26.84 | 97.61,25.76 R1.2
  pour Bottom: 90.09,24.79 96.02,24.79 96.02,26.79 98.02,26.79 98.02,28.29 100.52,28.29 100.52,24.29 110.77,24.29 110.77,19.79 90.59,19.79

### Text on the board
tNames: POLYMATH IOT / CONTROLLER